# Altium project ominosc.PrjPCB (part 1 of 2)
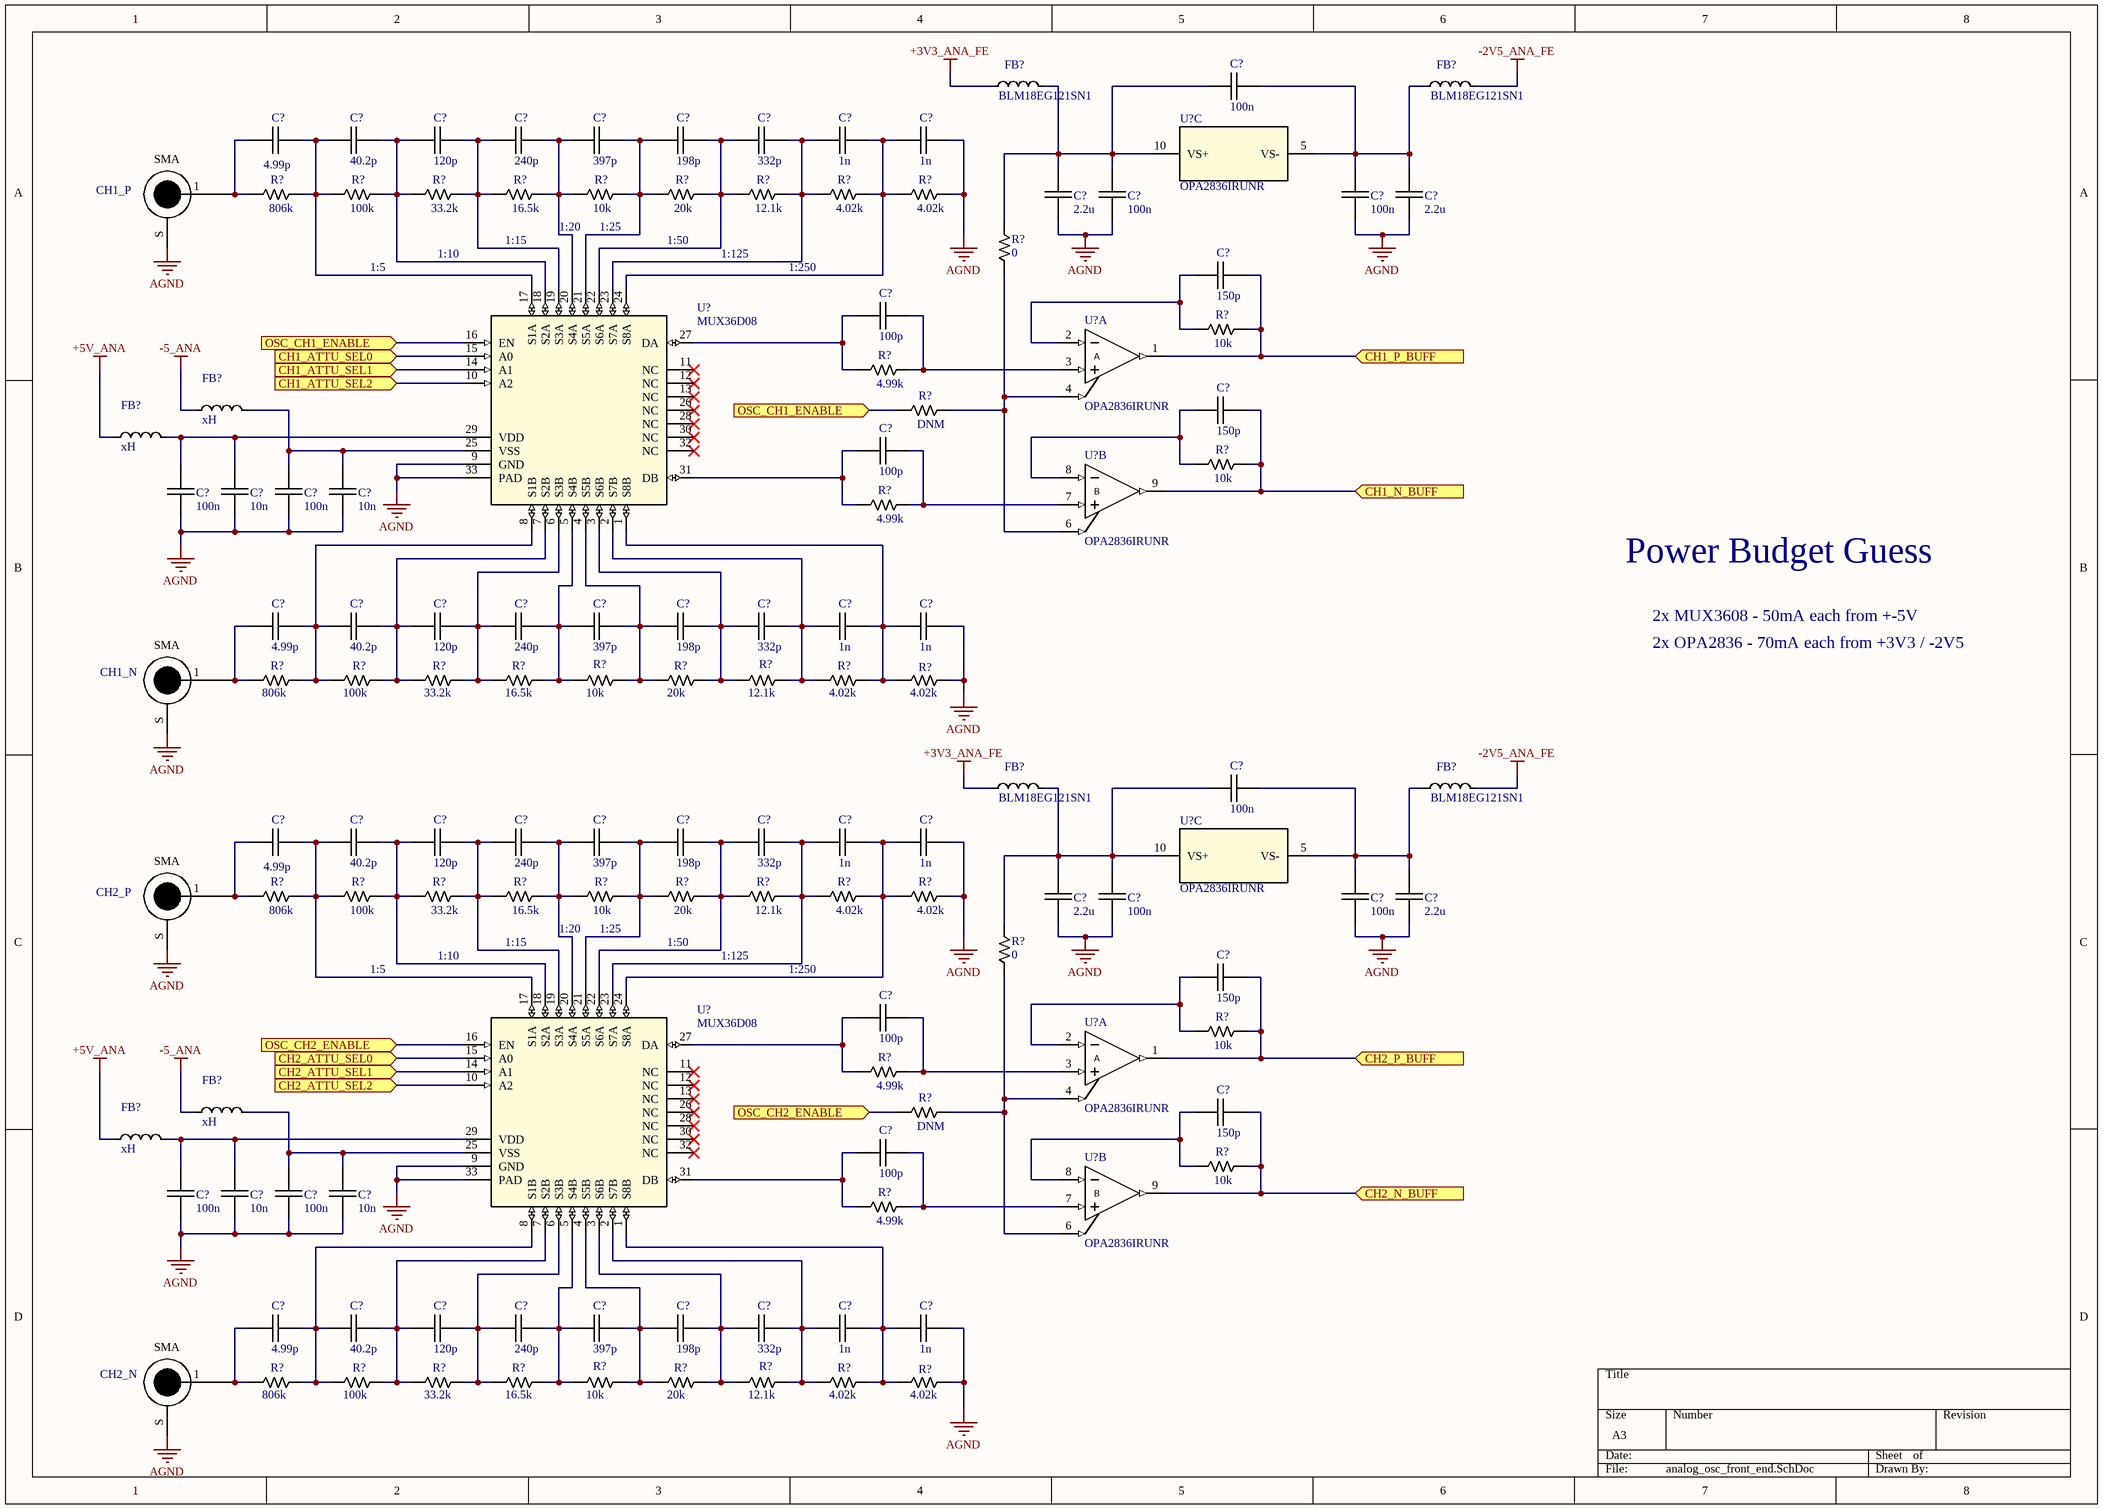
[diagram p0: analog_osc_front_end.SchDoc]
8 sheets, 454 parts. Net scope: flat (ports and power ports of the same name join across sheets).
Sheets:
  analog_osc_front_end.SchDoc
  analog_adc_front_end.SchDoc
  analog_clock_gen.SchDoc
  analog_adc_ref_offset.SchDoc
  analog_adc.SchDoc
  analog_power.SchDoc
  analog_dac.SchDoc
  analog_dac_ref_offset.SchDoc

## Sheet analog_osc_front_end.SchDoc
size A3

### Parts
(Parts that share a designator on the sheet are numbered #1, #2 ... from top to bottom, then left to right.)
C?#1  value 100n  [CAPC1005X06N]  (hidden comment: MLLC Capacitor)
C?#2  value 4.99p  [CAPC1005X06N]  (hidden comment: MLLC Capacitor)
C?#3  value 40.2p  [CAPC1005X06N]  (hidden comment: MLLC Capacitor)
C?#4  value 120p  [CAPC1005X06N]  (hidden comment: MLLC Capacitor)
C?#5  value 240p  [CAPC1005X06N]  (hidden comment: MLLC Capacitor)
C?#6  value 397p  [CAPC1005X06N]  (hidden comment: MLLC Capacitor)
C?#7  value 198p  [CAPC1005X06N]  (hidden comment: MLLC Capacitor)
C?#8  value 332p  [CAPC1005X06N]  (hidden comment: MLLC Capacitor)
C?#9  value 1n  [CAPC1005X06N]  (hidden comment: MLLC Capacitor)
C?#10  value 1n  [CAPC1005X06N]  (hidden comment: MLLC Capacitor)
C?#11  value 2.2u  [CAPC1005X06N]  (hidden comment: MLLC Capacitor)
C?#12  value 100n  [CAPC1005X06N]  (hidden comment: MLLC Capacitor)
C?#13  value 100n  [CAPC1005X06N]  (hidden comment: MLLC Capacitor)
C?#14  value 2.2u  [CAPC1005X06N]  (hidden comment: MLLC Capacitor)
C?#15  value 150p  [CAPC1005X06N]  (hidden comment: MLLC Capacitor)
C?#16  value 100p  [CAPC1005X06N]  (hidden comment: MLLC Capacitor)
C?#17  value 150p  [CAPC1005X06N]  (hidden comment: MLLC Capacitor)
C?#18  value 100p  [CAPC1005X06N]  (hidden comment: MLLC Capacitor)
C?#19  value 100n  [CAPC1005X06N]  (hidden comment: MLLC Capacitor)
C?#20  value 10n  [CAPC1005X06N]  (hidden comment: MLLC Capacitor)
C?#21  value 100n  [CAPC1005X06N]  (hidden comment: MLLC Capacitor)
C?#22  value 10n  [CAPC1005X06N]  (hidden comment: MLLC Capacitor)
C?#23  value 4.99p  [CAPC1005X06N]  (hidden comment: MLLC Capacitor)
C?#24  value 40.2p  [CAPC1005X06N]  (hidden comment: MLLC Capacitor)
C?#25  value 120p  [CAPC1005X06N]  (hidden comment: MLLC Capacitor)
C?#26  value 240p  [CAPC1005X06N]  (hidden comment: MLLC Capacitor)
C?#27  value 397p  [CAPC1005X06N]  (hidden comment: MLLC Capacitor)
C?#28  value 198p  [CAPC1005X06N]  (hidden comment: MLLC Capacitor)
C?#29  value 332p  [CAPC1005X06N]  (hidden comment: MLLC Capacitor)
C?#30  value 1n  [CAPC1005X06N]  (hidden comment: MLLC Capacitor)
C?#31  value 1n  [CAPC1005X06N]  (hidden comment: MLLC Capacitor)
C?#32  value 100n  [CAPC1005X06N]  (hidden comment: MLLC Capacitor)
C?#33  value 4.99p  [CAPC1005X06N]  (hidden comment: MLLC Capacitor)
C?#34  value 40.2p  [CAPC1005X06N]  (hidden comment: MLLC Capacitor)
C?#35  value 120p  [CAPC1005X06N]  (hidden comment: MLLC Capacitor)
C?#36  value 240p  [CAPC1005X06N]  (hidden comment: MLLC Capacitor)
C?#37  value 397p  [CAPC1005X06N]  (hidden comment: MLLC Capacitor)
C?#38  value 198p  [CAPC1005X06N]  (hidden comment: MLLC Capacitor)
C?#39  value 332p  [CAPC1005X06N]  (hidden comment: MLLC Capacitor)
C?#40  value 1n  [CAPC1005X06N]  (hidden comment: MLLC Capacitor)
C?#41  value 1n  [CAPC1005X06N]  (hidden comment: MLLC Capacitor)
C?#42  value 2.2u  [CAPC1005X06N]  (hidden comment: MLLC Capacitor)
C?#43  value 100n  [CAPC1005X06N]  (hidden comment: MLLC Capacitor)
C?#44  value 100n  [CAPC1005X06N]  (hidden comment: MLLC Capacitor)
C?#45  value 2.2u  [CAPC1005X06N]  (hidden comment: MLLC Capacitor)
C?#46  value 150p  [CAPC1005X06N]  (hidden comment: MLLC Capacitor)
C?#47  value 100p  [CAPC1005X06N]  (hidden comment: MLLC Capacitor)
C?#48  value 150p  [CAPC1005X06N]  (hidden comment: MLLC Capacitor)
C?#49  value 100p  [CAPC1005X06N]  (hidden comment: MLLC Capacitor)
C?#50  value 100n  [CAPC1005X06N]  (hidden comment: MLLC Capacitor)
C?#51  value 10n  [CAPC1005X06N]  (hidden comment: MLLC Capacitor)
C?#52  value 100n  [CAPC1005X06N]  (hidden comment: MLLC Capacitor)
C?#53  value 10n  [CAPC1005X06N]  (hidden comment: MLLC Capacitor)
C?#54  value 4.99p  [CAPC1005X06N]  (hidden comment: MLLC Capacitor)
C?#55  value 40.2p  [CAPC1005X06N]  (hidden comment: MLLC Capacitor)
C?#56  value 120p  [CAPC1005X06N]  (hidden comment: MLLC Capacitor)
C?#57  value 240p  [CAPC1005X06N]  (hidden comment: MLLC Capacitor)
C?#58  value 397p  [CAPC1005X06N]  (hidden comment: MLLC Capacitor)
C?#59  value 198p  [CAPC1005X06N]  (hidden comment: MLLC Capacitor)
C?#60  value 332p  [CAPC1005X06N]  (hidden comment: MLLC Capacitor)
C?#61  value 1n  [CAPC1005X06N]  (hidden comment: MLLC Capacitor)
C?#62  value 1n  [CAPC1005X06N]  (hidden comment: MLLC Capacitor)
CH1_N  SMA Edge  [SMA_EDGE]  (value not drawn)
CH1_P  SMA Edge  [SMA_EDGE]  (value not drawn)
CH2_N  SMA Edge  [SMA_EDGE]  (value not drawn)
CH2_P  SMA Edge  [SMA_EDGE]  (value not drawn)
FB?#1  value BLM18EG121SN1  [INDC1608X08N]  (hidden comment: Chip Inductor)
FB?#2  value BLM18EG121SN1  [INDC1608X08N]  (hidden comment: Chip Inductor)
FB?#3  value xH  [INDC2016X10N]  (hidden comment: Chip Inductor)
FB?#4  value xH  [INDC2016X10N]  (hidden comment: Chip Inductor)
FB?#5  value BLM18EG121SN1  [INDC1608X08N]  (hidden comment: Chip Inductor)
FB?#6  value BLM18EG121SN1  [INDC1608X08N]  (hidden comment: Chip Inductor)
FB?#7  value xH  [INDC2016X10N]  (hidden comment: Chip Inductor)
FB?#8  value xH  [INDC2016X10N]  (hidden comment: Chip Inductor)
R?#1  value 806k  [RESC1005X04N]  (hidden comment: Chip Resistor)
R?#2  value 100k  [RESC1005X04N]  (hidden comment: Chip Resistor)
R?#3  value 33.2k  [RESC1005X04N]  (hidden comment: Chip Resistor)
R?#4  value 16.5k  [RESC1005X04N]  (hidden comment: Chip Resistor)
R?#5  value 10k  [RESC1005X04N]  (hidden comment: Chip Resistor)
R?#6  value 20k  [RESC1005X04N]  (hidden comment: Chip Resistor)
R?#7  value 12.1k  [RESC1005X04N]  (hidden comment: Chip Resistor)
R?#8  value 4.02k  [RESC1005X04N]  (hidden comment: Chip Resistor)
R?#9  value 4.02k  [RESC1005X04N]  (hidden comment: Chip Resistor)
R?#10  value 0  [RESC1005X04N]  (hidden comment: Chip Resistor)
R?#11  value 10k  [RESC1005X04N]  (hidden comment: Chip Resistor)
R?#12  value 4.99k  [RESC1005X04N]  (hidden comment: Chip Resistor)
R?#13  value DNM  [RESC1005X04N]  (hidden comment: Chip Resistor)
R?#14  value 10k  [RESC1005X04N]  (hidden comment: Chip Resistor)
R?#15  value 4.99k  [RESC1005X04N]  (hidden comment: Chip Resistor)
R?#16  value 806k  [RESC1005X04N]  (hidden comment: Chip Resistor)
R?#17  value 100k  [RESC1005X04N]  (hidden comment: Chip Resistor)
R?#18  value 33.2k  [RESC1005X04N]  (hidden comment: Chip Resistor)
R?#19  value 16.5k  [RESC1005X04N]  (hidden comment: Chip Resistor)
R?#20  value 10k  [RESC1005X04N]  (hidden comment: Chip Resistor)
R?#21  value 20k  [RESC1005X04N]  (hidden comment: Chip Resistor)
R?#22  value 12.1k  [RESC1005X04N]  (hidden comment: Chip Resistor)
R?#23  value 4.02k  [RESC1005X04N]  (hidden comment: Chip Resistor)
R?#24  value 4.02k  [RESC1005X04N]  (hidden comment: Chip Resistor)
R?#25  value 806k  [RESC1005X04N]  (hidden comment: Chip Resistor)
R?#26  value 100k  [RESC1005X04N]  (hidden comment: Chip Resistor)
R?#27  value 33.2k  [RESC1005X04N]  (hidden comment: Chip Resistor)
R?#28  value 16.5k  [RESC1005X04N]  (hidden comment: Chip Resistor)
R?#29  value 10k  [RESC1005X04N]  (hidden comment: Chip Resistor)
R?#30  value 20k  [RESC1005X04N]  (hidden comment: Chip Resistor)
R?#31  value 12.1k  [RESC1005X04N]  (hidden comment: Chip Resistor)
R?#32  value 4.02k  [RESC1005X04N]  (hidden comment: Chip Resistor)
R?#33  value 4.02k  [RESC1005X04N]  (hidden comment: Chip Resistor)
R?#34  value 0  [RESC1005X04N]  (hidden comment: Chip Resistor)
R?#35  value 10k  [RESC1005X04N]  (hidden comment: Chip Resistor)
R?#36  value 4.99k  [RESC1005X04N]  (hidden comment: Chip Resistor)
R?#37  value DNM  [RESC1005X04N]  (hidden comment: Chip Resistor)
R?#38  value 10k  [RESC1005X04N]  (hidden comment: Chip Resistor)
R?#39  value 4.99k  [RESC1005X04N]  (hidden comment: Chip Resistor)
R?#40  value 806k  [RESC1005X04N]  (hidden comment: Chip Resistor)
R?#41  value 100k  [RESC1005X04N]  (hidden comment: Chip Resistor)
R?#42  value 33.2k  [RESC1005X04N]  (hidden comment: Chip Resistor)
R?#43  value 16.5k  [RESC1005X04N]  (hidden comment: Chip Resistor)
R?#44  value 10k  [RESC1005X04N]  (hidden comment: Chip Resistor)
R?#45  value 20k  [RESC1005X04N]  (hidden comment: Chip Resistor)
R?#46  value 12.1k  [RESC1005X04N]  (hidden comment: Chip Resistor)
R?#47  value 4.02k  [RESC1005X04N]  (hidden comment: Chip Resistor)
R?#48  value 4.02k  [RESC1005X04N]  (hidden comment: Chip Resistor)
U?#1  OPA2836IRUNR  [RUN0010A]  (part C of 3)
U?#2  OPA2836IRUNR  [RUN0010A]  (part A of 3)
U?#3  MUX36D08  [RTV0032E]
U?#4  OPA2836IRUNR  [RUN0010A]  (part B of 3)
U?#5  OPA2836IRUNR  [RUN0010A]  (part C of 3)
U?#6  OPA2836IRUNR  [RUN0010A]  (part A of 3)
U?#7  MUX36D08  [RTV0032E]
U?#8  OPA2836IRUNR  [RUN0010A]  (part B of 3)

### Ports
CH1_ATTU_SEL0 (in), CH1_ATTU_SEL1 (in), CH1_ATTU_SEL2 (in), CH1_N_BUFF (in), CH1_P_BUFF (in), CH2_ATTU_SEL0 (in), CH2_ATTU_SEL1 (in), CH2_ATTU_SEL2 (in), CH2_N_BUFF (in), CH2_P_BUFF (in), OSC_CH1_ENABLE (in), OSC_CH2_ENABLE (in)

### Nets
+3V3_ANA_FE: FB?#1.1 FB?#5.1
+5V_ANA: FB?#4.1 FB?#8.1
-2V5_ANA_FE: FB?#2.2 FB?#6.2
-5_ANA: FB?#3.1 FB?#7.1
AGND: C?#10.2 C?#11.1 C?#12.1 C?#13.1 C?#14.1 C?#19.1 C?#20.1 C?#21.1 C?#22.1 C?#31.2 C?#41.2 C?#42.1 C?#43.1 C?#44.1 C?#45.1 C?#50.1 C?#51.1 C?#52.1 C?#53.1 C?#62.2 CH1_N.S CH1_P.S CH2_N.S CH2_P.S R?#9.2 R?#24.2 R?#33.2 R?#48.2 U?#3.9(GND) U?#3.33(PAD) U?#7.9(GND) U?#7.33(PAD)
NetC?#1_1: C?#1.1 C?#13.2 C?#14.2 FB?#2.1 U?#1.5(VS-)
NetC?#1_2: C?#1.2 C?#11.2 C?#12.2 FB?#1.2 R?#10.2 U?#1.10(VS+)
NetC?#2_1: C?#2.1 CH1_P.1(FEED) R?#1.1
NetC?#2_2: C?#2.2 C?#3.1 R?#1.2 R?#2.1 U?#3.17(S1A)
NetC?#3_2: C?#3.2 C?#4.1 R?#2.2 R?#3.1 U?#3.18(S2A)
NetC?#4_2: C?#4.2 C?#5.1 R?#3.2 R?#4.1 U?#3.19(S3A)
NetC?#5_2: C?#5.2 C?#6.1 R?#4.2 R?#5.1 U?#3.20(S4A)
NetC?#6_2: C?#6.2 C?#7.1 R?#5.2 R?#6.1 U?#3.21(S5A)
NetC?#7_2: C?#7.2 C?#8.1 R?#6.2 R?#7.1 U?#3.22(S6A)
NetC?#8_2: C?#8.2 C?#9.1 R?#7.2 R?#8.1 U?#3.23(S7A)
NetC?#9_2: C?#9.2 C?#10.1 R?#8.2 R?#9.1 U?#3.24(S8A)
NetC?#15_1: C?#15.1 R?#11.1 U?#2.2(IN-)
NetC?#15_2: C?#15.2 R?#11.2 U?#2.1(VOUT1) ; port CH1_P_BUFF
NetC?#16_1: C?#16.1 R?#12.1 U?#3.27(DA)
NetC?#16_2: C?#16.2 R?#12.2 U?#2.3(IN+)
NetC?#17_1: C?#17.1 R?#14.1 U?#4.8(IN-)
NetC?#17_2: C?#17.2 R?#14.2 U?#4.9(VOUT2) ; port CH1_N_BUFF
NetC?#18_1: C?#18.1 R?#15.1 U?#3.31(DB)
NetC?#18_2: C?#18.2 R?#15.2 U?#4.7(IN+)
NetC?#19_2: C?#19.2 C?#20.2 FB?#4.2 U?#3.29(VDD)
NetC?#21_2: C?#21.2 C?#22.2 FB?#3.2 U?#3.25(VSS)
NetC?#23_1: C?#23.1 CH1_N.1(FEED) R?#16.1
NetC?#23_2: C?#23.2 C?#24.1 R?#16.2 R?#17.1 U?#3.8(S1B)
NetC?#24_2: C?#24.2 C?#25.1 R?#17.2 R?#18.1 U?#3.7(S2B)
NetC?#25_2: C?#25.2 C?#26.1 R?#18.2 R?#19.1 U?#3.6(S3B)
NetC?#26_2: C?#26.2 C?#27.1 R?#19.2 R?#20.1 U?#3.5(S4B)
NetC?#27_2: C?#27.2 C?#28.1 R?#20.2 R?#21.1 U?#3.4(S5B)
NetC?#28_2: C?#28.2 C?#29.1 R?#21.2 R?#22.1 U?#3.3(S6B)
NetC?#29_2: C?#29.2 C?#30.1 R?#22.2 R?#23.1 U?#3.2(S7B)
NetC?#30_2: C?#30.2 C?#31.1 R?#23.2 R?#24.1 U?#3.1(S8B)
NetC?#32_1: C?#32.1 C?#44.2 C?#45.2 FB?#6.1 U?#5.5(VS-)
NetC?#32_2: C?#32.2 C?#42.2 C?#43.2 FB?#5.2 R?#34.2 U?#5.10(VS+)
NetC?#33_1: C?#33.1 CH2_P.1(FEED) R?#25.1
NetC?#33_2: C?#33.2 C?#34.1 R?#25.2 R?#26.1 U?#7.17(S1A)
NetC?#34_2: C?#34.2 C?#35.1 R?#26.2 R?#27.1 U?#7.18(S2A)
NetC?#35_2: C?#35.2 C?#36.1 R?#27.2 R?#28.1 U?#7.19(S3A)
NetC?#36_2: C?#36.2 C?#37.1 R?#28.2 R?#29.1 U?#7.20(S4A)
NetC?#37_2: C?#37.2 C?#38.1 R?#29.2 R?#30.1 U?#7.21(S5A)
NetC?#38_2: C?#38.2 C?#39.1 R?#30.2 R?#31.1 U?#7.22(S6A)
NetC?#39_2: C?#39.2 C?#40.1 R?#31.2 R?#32.1 U?#7.23(S7A)
NetC?#40_2: C?#40.2 C?#41.1 R?#32.2 R?#33.1 U?#7.24(S8A)
NetC?#46_1: C?#46.1 R?#35.1 U?#6.2(IN-)
NetC?#46_2: C?#46.2 R?#35.2 U?#6.1(VOUT1) ; port CH2_P_BUFF
NetC?#47_1: C?#47.1 R?#36.1 U?#7.27(DA)
NetC?#47_2: C?#47.2 R?#36.2 U?#6.3(IN+)
NetC?#48_1: C?#48.1 R?#38.1 U?#8.8(IN-)
NetC?#48_2: C?#48.2 R?#38.2 U?#8.9(VOUT2) ; port CH2_N_BUFF
NetC?#49_1: C?#49.1 R?#39.1 U?#7.31(DB)
NetC?#49_2: C?#49.2 R?#39.2 U?#8.7(IN+)
NetC?#50_2: C?#50.2 C?#51.2 FB?#8.2 U?#7.29(VDD)
NetC?#52_2: C?#52.2 C?#53.2 FB?#7.2 U?#7.25(VSS)
NetC?#54_1: C?#54.1 CH2_N.1(FEED) R?#40.1
NetC?#54_2: C?#54.2 C?#55.1 R?#40.2 R?#41.1 U?#7.8(S1B)
NetC?#55_2: C?#55.2 C?#56.1 R?#41.2 R?#42.1 U?#7.7(S2B)
NetC?#56_2: C?#56.2 C?#57.1 R?#42.2 R?#43.1 U?#7.6(S3B)
NetC?#57_2: C?#57.2 C?#58.1 R?#43.2 R?#44.1 U?#7.5(S4B)
NetC?#58_2: C?#58.2 C?#59.1 R?#44.2 R?#45.1 U?#7.4(S5B)
NetC?#59_2: C?#59.2 C?#60.1 R?#45.2 R?#46.1 U?#7.3(S6B)
NetC?#60_2: C?#60.2 C?#61.1 R?#46.2 R?#47.1 U?#7.2(S7B)
NetC?#61_2: C?#61.2 C?#62.1 R?#47.2 R?#48.1 U?#7.1(S8B)
NetR?#10_1: R?#10.1 R?#13.2 U?#2.4(PD1_N) U?#4.6(PD2_N)
NetR?#13_1: R?#13.1 U?#3.16(EN) ; port OSC_CH1_ENABLE
NetR?#34_1: R?#34.1 R?#37.2 U?#6.4(PD1_N) U?#8.6(PD2_N)
NetR?#37_1: R?#37.1 U?#7.16(EN) ; port OSC_CH2_ENABLE
NetU?#3_10: U?#3.10(A2) ; port CH1_ATTU_SEL2
NetU?#3_14: U?#3.14(A1) ; port CH1_ATTU_SEL1
NetU?#3_15: U?#3.15(A0) ; port CH1_ATTU_SEL0
NetU?#7_10: U?#7.10(A2) ; port CH2_ATTU_SEL2
NetU?#7_14: U?#7.14(A1) ; port CH2_ATTU_SEL1
NetU?#7_15: U?#7.15(A0) ; port CH2_ATTU_SEL0

Not connected (* = marked no-connect by the designer): U?#3 11(NC)* 12(NC)* 13(NC)* 26(NC)* 28(NC)* 30(NC)* 32(NC)*; U?#7 11(NC)* 12(NC)* 13(NC)* 26(NC)* 28(NC)* 30(NC)* 32(NC)*

### Notes on the sheet
- (near R?#4) 1:15
- (near R?#5) 1:20
- (near R?#5) 1:25
- (near R?#6) 1:50
- 1:5
- 1:10
- 1:125
- 1:250
- Power Budget Guess
- 2x MUX3608 - 50mA each from +-5V
- 2x OPA2836 - 70mA each from +3V3 / -2V5
- (near R?#28) 1:15
- (near R?#29) 1:20
- (near R?#29) 1:25
- (near R?#30) 1:50
- (in symbol OPA2836IRUNR, part A) A
- (in symbol OPA2836IRUNR, part B) B
- (in symbol SMA Edge) SMA

### Library data of the parts
C?#1-C?#62 = Cap: Rating: *
CH1_N CH1_P CH2_N CH2_P = SMA Edge: Right Angle Edge Connector 1.6mm
FB?#1-FB?#8 = Ind
R?#1-R?#48 = Res
U?#1 U?#2 U?#4-U?#6 U?#8 = OPA2836IRUNR: Dual, Very Low Power, Rail to Rail out, Negative Rail in, VFB Op Amp, 205MHz BW, 120 MHz GBW; Manufacturer: Texas Instruments; PartNumber: OPA2836IRUNR; RefDes: RefDes; Type: DEV; Value: Value; Copyright: Copyright (C) 2018 Accelerated Designs. All rights reserved; ComponentLink1Description: Product Page; ComponentLink1URL: https://www.ti.com/product/OPA2836
U?#3 U?#7 = MUX36D08: 1-pA on-state leakage current, 36-V,dual 8:1, precision analog multiplexer; Manufacturer: Texas Instruments; PartNumber: MUX36D08IRTVR; RefDes: RefDes; Type: DEV; Value: Value; Copyright: Copyright (C) 2018 Accelerated Designs. All rights reserved; ComponentLink1Description: Product Page; ComponentLink1URL: https://www.ti.com/product/MUX36D08

## Sheet analog_adc_front_end.SchDoc
size A3
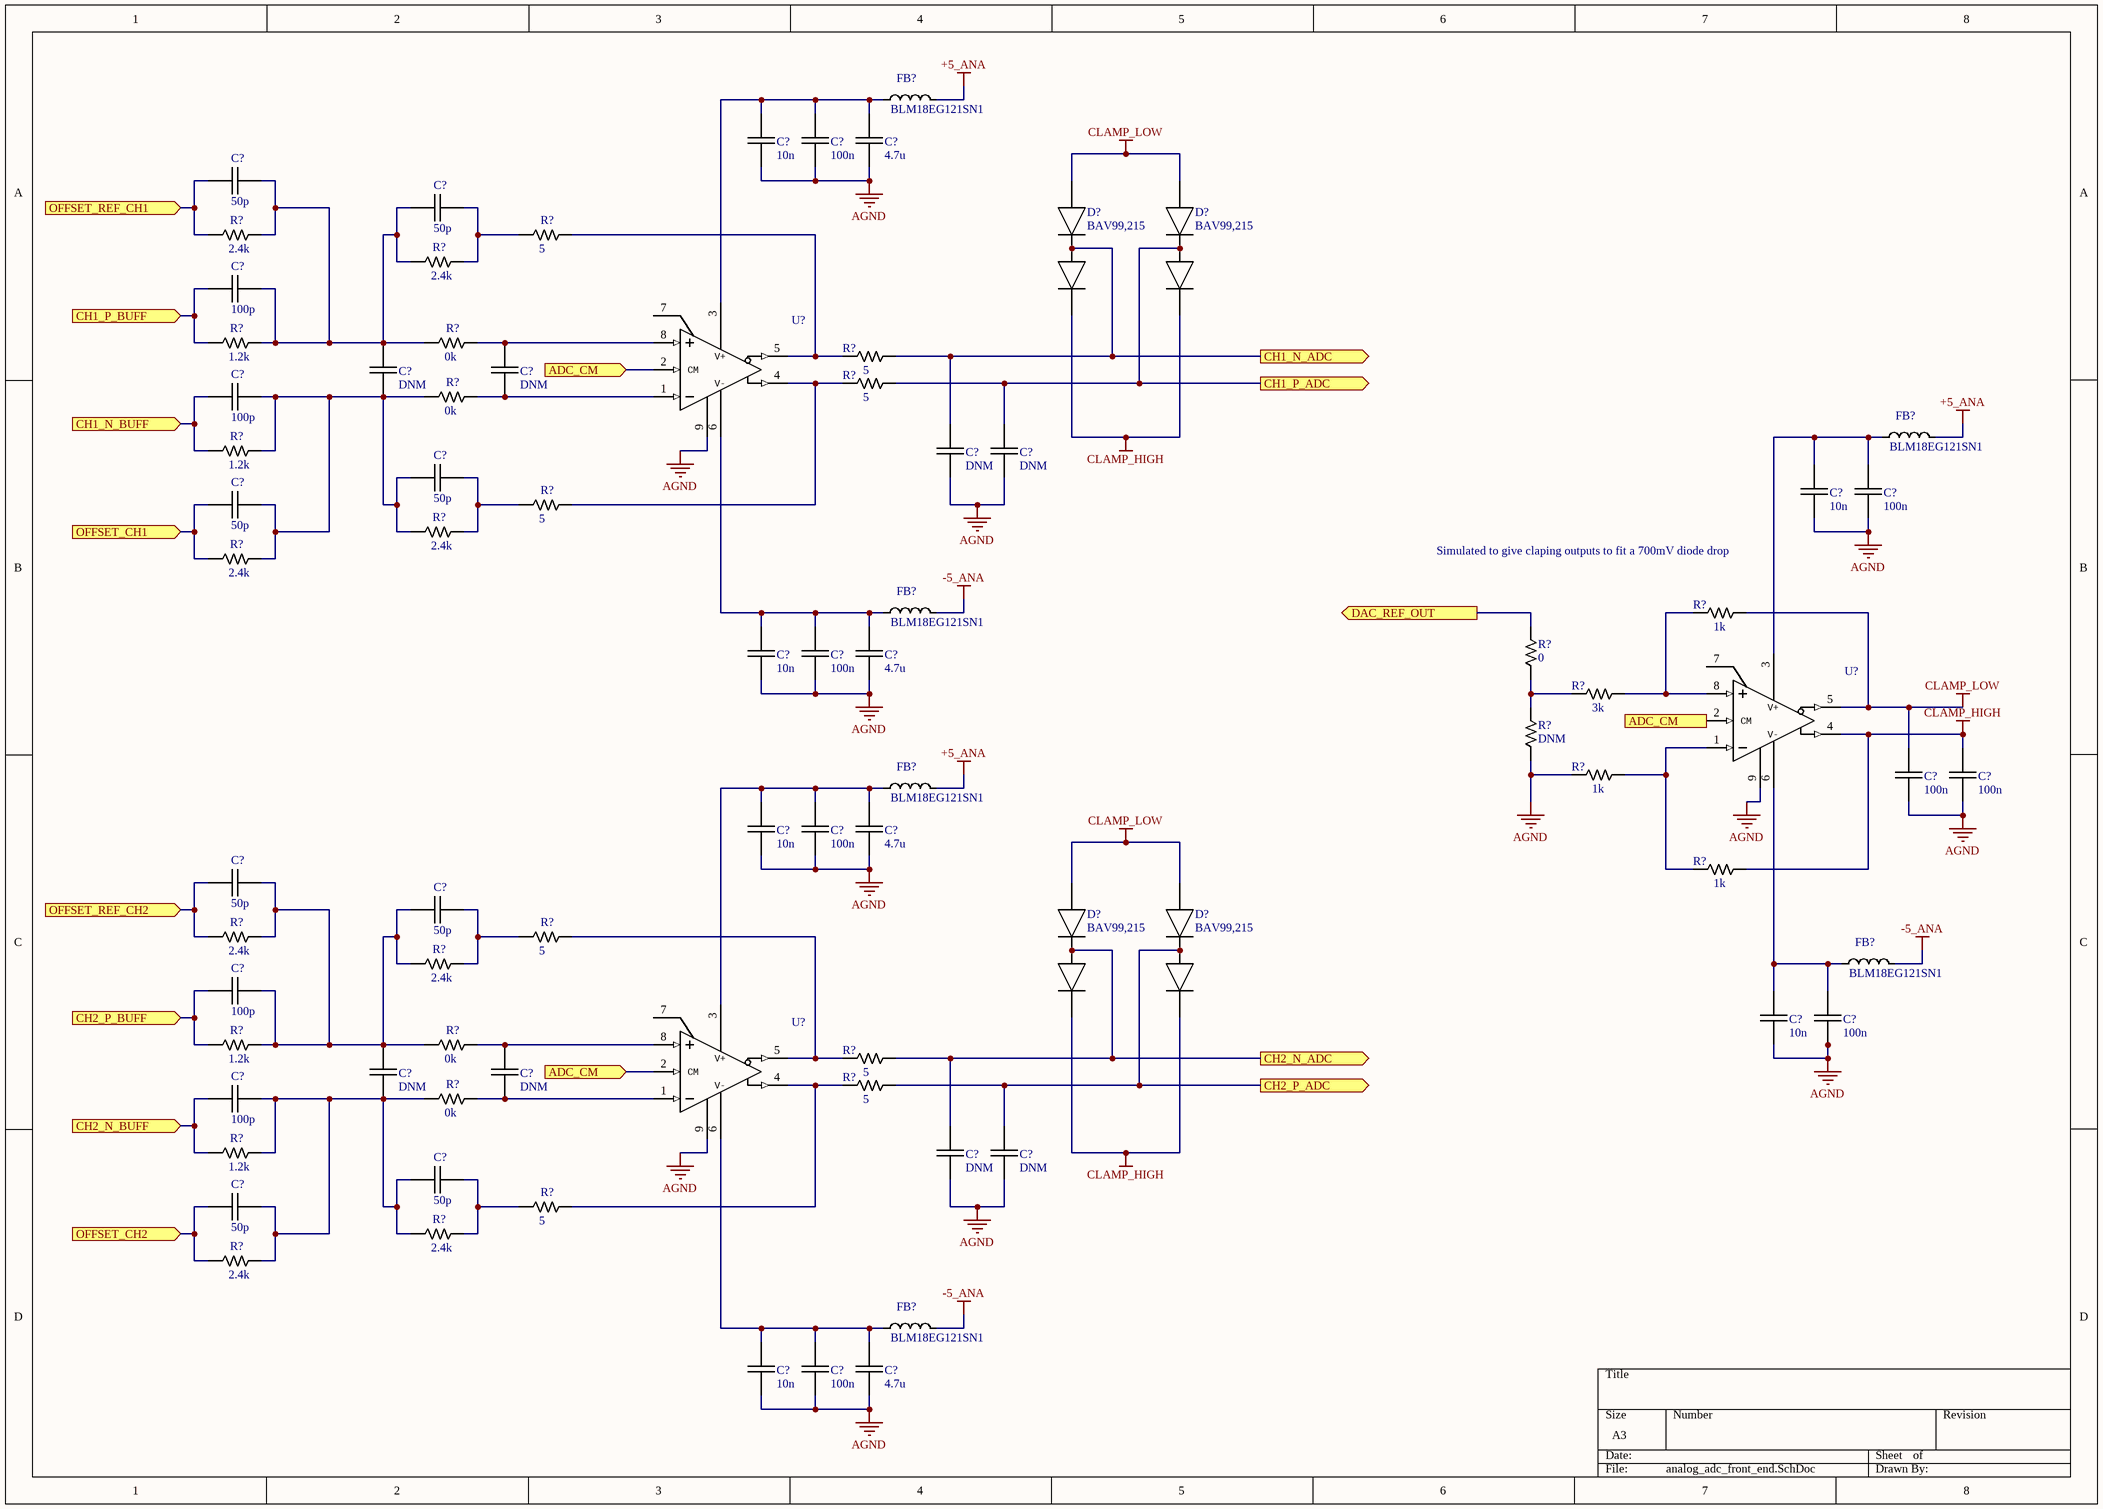
[diagram p1: analog_adc_front_end.SchDoc]

### Parts
(Parts that share a designator on the sheet are numbered #1, #2 ... from top to bottom, then left to right.)
C?#63  value 10n  [CAPC1005X06N]  (hidden comment: MLLC Capacitor)
C?#64  value 100n  [CAPC1005X06N]  (hidden comment: MLLC Capacitor)
C?#65  value 4.7u  [CAPC1608X09N]  (hidden comment: MLLC Capacitor)
C?#66  value 50p  [CAPC1005X06N]  (hidden comment: MLLC Capacitor)
C?#67  value 50p  [CAPC1005X06N]  (hidden comment: MLLC Capacitor)
C?#68  value 100p  [CAPC1005X06N]  (hidden comment: MLLC Capacitor)
C?#69  value DNM  [CAPC1005X06N]  (hidden comment: MLLC Capacitor)
C?#70  value DNM  [CAPC1005X06N]  (hidden comment: MLLC Capacitor)
C?#71  value 100p  [CAPC1005X06N]  (hidden comment: MLLC Capacitor)
C?#72  value DNM  [CAPC1005X06N]  (hidden comment: MLLC Capacitor)
C?#73  value DNM  [CAPC1005X06N]  (hidden comment: MLLC Capacitor)
C?#74  value 50p  [CAPC1005X06N]  (hidden comment: MLLC Capacitor)
C?#75  value 10n  [CAPC1005X06N]  (hidden comment: MLLC Capacitor)
C?#76  value 100n  [CAPC1005X06N]  (hidden comment: MLLC Capacitor)
C?#77  value 50p  [CAPC1005X06N]  (hidden comment: MLLC Capacitor)
C?#78  value 10n  [CAPC1005X06N]  (hidden comment: MLLC Capacitor)
C?#79  value 100n  [CAPC1005X06N]  (hidden comment: MLLC Capacitor)
C?#80  value 4.7u  [CAPC1608X09N]  (hidden comment: MLLC Capacitor)
C?#81  value 100n  [CAPC1005X06N]  (hidden comment: MLLC Capacitor)
C?#82  value 100n  [CAPC1005X06N]  (hidden comment: MLLC Capacitor)
C?#83  value 10n  [CAPC1005X06N]  (hidden comment: MLLC Capacitor)
C?#84  value 100n  [CAPC1005X06N]  (hidden comment: MLLC Capacitor)
C?#85  value 4.7u  [CAPC1608X09N]  (hidden comment: MLLC Capacitor)
C?#86  value 50p  [CAPC1005X06N]  (hidden comment: MLLC Capacitor)
C?#87  value 50p  [CAPC1005X06N]  (hidden comment: MLLC Capacitor)
C?#88  value 100p  [CAPC1005X06N]  (hidden comment: MLLC Capacitor)
C?#89  value 10n  [CAPC1005X06N]  (hidden comment: MLLC Capacitor)
C?#90  value 100n  [CAPC1005X06N]  (hidden comment: MLLC Capacitor)
C?#91  value DNM  [CAPC1005X06N]  (hidden comment: MLLC Capacitor)
C?#92  value DNM  [CAPC1005X06N]  (hidden comment: MLLC Capacitor)
C?#93  value 100p  [CAPC1005X06N]  (hidden comment: MLLC Capacitor)
C?#94  value DNM  [CAPC1005X06N]  (hidden comment: MLLC Capacitor)
C?#95  value DNM  [CAPC1005X06N]  (hidden comment: MLLC Capacitor)
C?#96  value 50p  [CAPC1005X06N]  (hidden comment: MLLC Capacitor)
C?#97  value 50p  [CAPC1005X06N]  (hidden comment: MLLC Capacitor)
C?#98  value 10n  [CAPC1005X06N]  (hidden comment: MLLC Capacitor)
C?#99  value 100n  [CAPC1005X06N]  (hidden comment: MLLC Capacitor)
C?#100  value 4.7u  [CAPC1608X09N]  (hidden comment: MLLC Capacitor)
D?#1  BAV99,215  [SOT95P245X110-3N]
D?#2  BAV99,215  [SOT95P245X110-3N]
D?#3  BAV99,215  [SOT95P245X110-3N]
D?#4  BAV99,215  [SOT95P245X110-3N]
FB?#9  value BLM18EG121SN1  [INDC1608X08N]  (hidden comment: Chip Inductor)
FB?#10  value BLM18EG121SN1  [INDC1608X08N]  (hidden comment: Chip Inductor)
FB?#11  value BLM18EG121SN1  [INDC1608X08N]  (hidden comment: Chip Inductor)
FB?#12  value BLM18EG121SN1  [INDC1608X08N]  (hidden comment: Chip Inductor)
FB?#13  value BLM18EG121SN1  [INDC1608X08N]  (hidden comment: Chip Inductor)
FB?#14  value BLM18EG121SN1  [INDC1608X08N]  (hidden comment: Chip Inductor)
R?#49  value 2.4k  [RESC1005X04N]  (hidden comment: Chip Resistor)
R?#50  value 5  [RESC1005X04N]  (hidden comment: Chip Resistor)
R?#51  value 2.4k  [RESC1005X04N]  (hidden comment: Chip Resistor)
R?#52  value 1.2k  [RESC1005X04N]  (hidden comment: Chip Resistor)
R?#53  value 0k  [RESC1005X04N]  (hidden comment: Chip Resistor)
R?#54  value 5  [RESC1005X04N]  (hidden comment: Chip Resistor)
R?#55  value 5  [RESC1005X04N]  (hidden comment: Chip Resistor)
R?#56  value 0k  [RESC1005X04N]  (hidden comment: Chip Resistor)
R?#57  value 1.2k  [RESC1005X04N]  (hidden comment: Chip Resistor)
R?#58  value 5  [RESC1005X04N]  (hidden comment: Chip Resistor)
R?#59  value 2.4k  [RESC1005X04N]  (hidden comment: Chip Resistor)
R?#60  value 2.4k  [RESC1005X04N]  (hidden comment: Chip Resistor)
R?#61  value 1k  [RESC1005X04N]  (hidden comment: Chip Resistor)
R?#62  value 0  [RESC1005X04N]  (hidden comment: Chip Resistor)
R?#63  value 3k  [RESC1005X04N]  (hidden comment: Chip Resistor)
R?#64  value DNM  [RESC1005X04N]  (hidden comment: Chip Resistor)
R?#65  value 1k  [RESC1005X04N]  (hidden comment: Chip Resistor)
R?#66  value 1k  [RESC1005X04N]  (hidden comment: Chip Resistor)
R?#67  value 2.4k  [RESC1005X04N]  (hidden comment: Chip Resistor)
R?#68  value 5  [RESC1005X04N]  (hidden comment: Chip Resistor)
R?#69  value 2.4k  [RESC1005X04N]  (hidden comment: Chip Resistor)
R?#70  value 1.2k  [RESC1005X04N]  (hidden comment: Chip Resistor)
R?#71  value 0k  [RESC1005X04N]  (hidden comment: Chip Resistor)
R?#72  value 5  [RESC1005X04N]  (hidden comment: Chip Resistor)
R?#73  value 5  [RESC1005X04N]  (hidden comment: Chip Resistor)
R?#74  value 0k  [RESC1005X04N]  (hidden comment: Chip Resistor)
R?#75  value 1.2k  [RESC1005X04N]  (hidden comment: Chip Resistor)
R?#76  value 5  [RESC1005X04N]  (hidden comment: Chip Resistor)
R?#77  value 2.4k  [RESC1005X04N]  (hidden comment: Chip Resistor)
R?#78  value 2.4k  [RESC1005X04N]  (hidden comment: Chip Resistor)
U?#9  THS4131CDGN  [DGN0008D_N]  (value not drawn)
U?#10  THS4131CDGN  [DGN0008D_N]  (value not drawn)
U?#11  THS4131CDGN  [DGN0008D_N]  (value not drawn)

### Ports
ADC_CM (in), CH1_N_ADC (out), CH1_N_BUFF (in), CH1_P_ADC (out), CH1_P_BUFF (in), CH2_N_ADC (out), CH2_N_BUFF (in), CH2_P_ADC (out), CH2_P_BUFF (in), DAC_REF_OUT (out), OFFSET_CH1 (in), OFFSET_CH2 (in), OFFSET_REF_CH1 (in), OFFSET_REF_CH2 (in)

### Nets
+5_ANA: FB?#9.2 FB?#10.2 FB?#12.2
-5_ANA: FB?#11.2 FB?#13.2 FB?#14.2
AGND: C?#63.1 C?#64.1 C?#65.1 C?#72.1 C?#73.1 C?#75.1 C?#76.1 C?#78.1 C?#79.1 C?#80.1 C?#81.1 C?#82.1 C?#83.1 C?#84.1 C?#85.1 C?#89.1 C?#90.1 C?#94.1 C?#95.1 C?#98.1 C?#99.1 C?#100.1 R?#64.1 R?#65.1 U?#9.9(PAD) U?#10.9(PAD) U?#11.9(PAD)
CLAMP_HIGH: C?#82.2 D?#1.2 D?#2.2 D?#3.2 D?#4.2 R?#66.2 U?#10.4(VOUT+)
CLAMP_LOW: C?#81.2 D?#1.1 D?#2.1 D?#3.1 D?#4.1 R?#61.2 U?#10.5(VOUT-)
DAC_REF_OUT: R?#62.2 ; port DAC_REF_OUT
NetC?#15_2: C?#68.1 R?#52.1 ; port CH1_P_BUFF
NetC?#17_2: C?#71.1 R?#57.1 ; port CH1_N_BUFF
NetC?#46_2: C?#88.1 R?#70.1 ; port CH2_P_BUFF
NetC?#48_2: C?#93.1 R?#75.1 ; port CH2_N_BUFF
NetC?#63_2: C?#63.2 C?#64.2 C?#65.2 FB?#9.1 U?#9.3(VCC+)
NetC?#66_1: C?#66.1 R?#49.1 ; port OFFSET_REF_CH1
NetC?#66_2: C?#66.2 C?#67.1 C?#68.2 C?#69.2 R?#49.2 R?#51.1 R?#52.2 R?#53.1
NetC?#67_2: C?#67.2 R?#50.1 R?#51.2
NetC?#69_1: C?#69.1 C?#71.2 C?#74.1 C?#77.2 R?#56.1 R?#57.2 R?#59.1 R?#60.2
NetC?#70_1: C?#70.1 R?#56.2 U?#9.1(VIN-)
NetC?#70_2: C?#70.2 R?#53.2 U?#9.8(VIN+)
NetC?#72_2: C?#72.2 D?#1.3 R?#54.2 ; port CH1_N_ADC
NetC?#73_2: C?#73.2 D?#2.3 R?#55.2 ; port CH1_P_ADC
NetC?#74_2: C?#74.2 R?#58.1 R?#59.2
NetC?#75_2: C?#75.2 C?#76.2 FB?#10.1 U?#10.3(VCC+)
NetC?#77_1: C?#77.1 R?#60.1 ; port OFFSET_CH1
NetC?#78_2: C?#78.2 C?#79.2 C?#80.2 FB?#11.1 U?#9.6(VCC-)
NetC?#83_2: C?#83.2 C?#84.2 C?#85.2 FB?#12.1 U?#11.3(VCC+)
NetC?#86_1: C?#86.1 R?#67.1 ; port OFFSET_REF_CH2
NetC?#86_2: C?#86.2 C?#87.1 C?#88.2 C?#91.2 R?#67.2 R?#69.1 R?#70.2 R?#71.1
NetC?#87_2: C?#87.2 R?#68.1 R?#69.2
NetC?#89_2: C?#89.2 C?#90.2 FB?#13.1 U?#10.6(VCC-)
NetC?#91_1: C?#91.1 C?#93.2 C?#96.1 C?#97.2 R?#74.1 R?#75.2 R?#77.1 R?#78.2
NetC?#92_1: C?#92.1 R?#74.2 U?#11.1(VIN-)
NetC?#92_2: C?#92.2 R?#71.2 U?#11.8(VIN+)
NetC?#94_2: C?#94.2 D?#3.3 R?#72.2 ; port CH2_N_ADC
NetC?#95_2: C?#95.2 D?#4.3 R?#73.2 ; port CH2_P_ADC
NetC?#96_2: C?#96.2 R?#76.1 R?#77.2
NetC?#97_1: C?#97.1 R?#78.1 ; port OFFSET_CH2
NetC?#98_2: C?#98.2 C?#99.2 C?#100.2 FB?#14.1 U?#11.6(VCC-)
NetC?#132_1: U?#9.2(VOCM) U?#10.2(VOCM) U?#11.2(VOCM) ; port ADC_CM
NetR?#50_2: R?#50.2 R?#54.1 U?#9.5(VOUT-)
NetR?#55_1: R?#55.1 R?#58.2 U?#9.4(VOUT+)
NetR?#61_1: R?#61.1 R?#63.2 U?#10.8(VIN+)
NetR?#62_1: R?#62.1 R?#63.1 R?#64.2
NetR?#65_2: R?#65.2 R?#66.1 U?#10.1(VIN-)
NetR?#68_2: R?#68.2 R?#72.1 U?#11.5(VOUT-)
NetR?#73_1: R?#73.1 R?#76.2 U?#11.4(VOUT+)

Not connected (* = marked no-connect by the designer): U?#9 7(NC); U?#10 7(NC); U?#11 7(NC)

### Notes on the sheet
- Simulated to give claping outputs to fit a 700mV diode drop
- (in symbol THS4131) V+; CM; V-

### Library data of the parts
C?#63-C?#100 = Cap: Rating: *
D?#1-D?#4 = BAV99,215: Diode Standard 100V 215mA Surface Mount SOT23, fast/ ultra-fast 4ns.
FB?#9-FB?#14 = Ind
R?#49-R?#78 = Res
U?#9-U?#11 = THS4131: Fully Differential Input/Output Low Noise Amplifier; PartNumber: THS4131CDGNR; Manufacturer: Texas Instruments; CompType: IC; PIN_COUNT: 9; Alternate_PartNumber: THS4131CDGN; PackageReference: DGN0008D; MountType: SMT; RoHS: Y; RefDes: RefDes; Type: DEV; Value: Value; Copyright: Copyright (C) 2018 Accelerated Designs. All rights reserved; ComponentLink1Description: Product Page; ComponentLink1URL: https://www.ti.com/product/THS4131

## Sheet analog_clock_gen.SchDoc
size A4
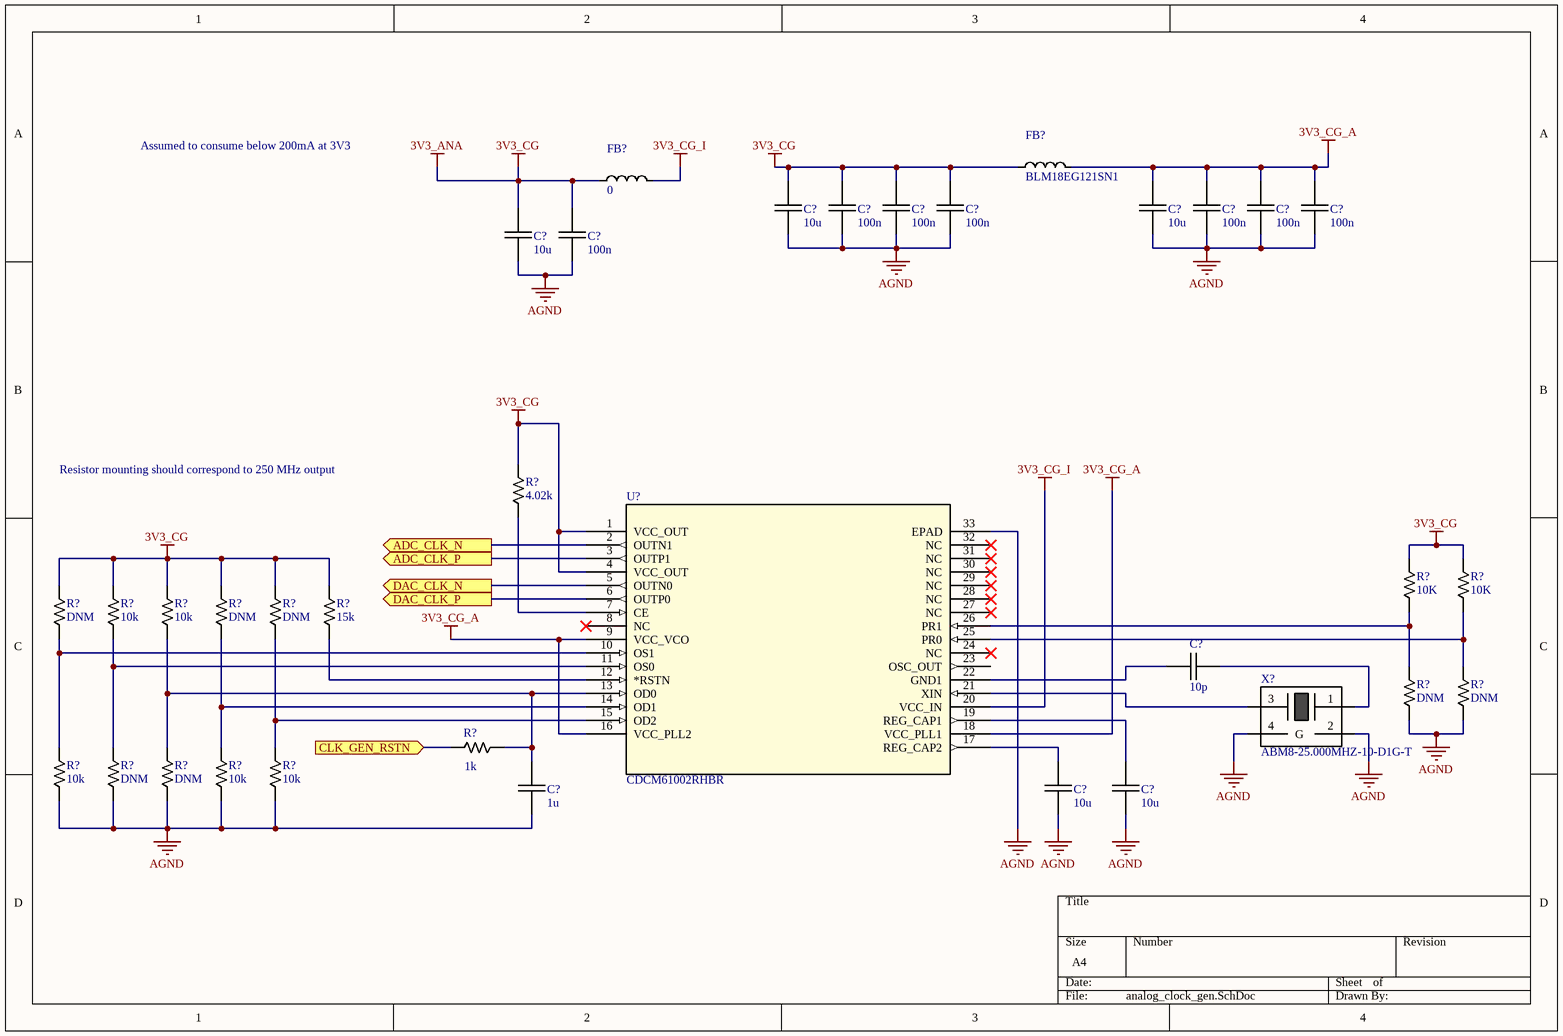
[diagram p2: analog_clock_gen.SchDoc]

### Parts
(Parts that share a designator on the sheet are numbered #1, #2 ... from top to bottom, then left to right.)
C?#101  value 10u  [CAPC1608X09N]  (hidden comment: MLLC Capacitor)
C?#102  value 100n  [CAPC1005X06N]  (hidden comment: MLLC Capacitor)
C?#103  value 100n  [CAPC1005X06N]  (hidden comment: MLLC Capacitor)
C?#104  value 100n  [CAPC1005X06N]  (hidden comment: MLLC Capacitor)
C?#105  value 10u  [CAPC1608X09N]  (hidden comment: MLLC Capacitor)
C?#106  value 100n  [CAPC1005X06N]  (hidden comment: MLLC Capacitor)
C?#107  value 100n  [CAPC1005X06N]  (hidden comment: MLLC Capacitor)
C?#108  value 100n  [CAPC1005X06N]  (hidden comment: MLLC Capacitor)
C?#109  value 10u  [CAPC1608X09N]  (hidden comment: MLLC Capacitor)
C?#110  value 100n  [CAPC1005X06N]  (hidden comment: MLLC Capacitor)
C?#111  value 10p  [CAPC1005X06N]  (hidden comment: MLLC Capacitor)
C?#112  value 1u  [CAPC1005X06N]  (hidden comment: MLLC Capacitor)
C?#113  value 10u  [CAPC1608X09N]  (hidden comment: MLLC Capacitor)
C?#114  value 10u  [CAPC1608X09N]  (hidden comment: MLLC Capacitor)
FB?#15  value BLM18EG121SN1  [INDC1608X08N]  (hidden comment: Chip Inductor)
FB?#16  value 0  [INDC1608X08N]  (hidden comment: Chip Inductor)
R?#79  value 4.02k  [RESC3216X06N]  (hidden comment: Chip Resistor)
R?#80  value 10K  [RESC3216X06N]  (hidden comment: Chip Resistor)
R?#81  value 10K  [RESC3216X06N]  (hidden comment: Chip Resistor)
R?#82  value DNM  [RESC3216X06N]  (hidden comment: Chip Resistor)
R?#83  value 10k  [RESC3216X06N]  (hidden comment: Chip Resistor)
R?#84  value 10k  [RESC3216X06N]  (hidden comment: Chip Resistor)
R?#85  value DNM  [RESC3216X06N]  (hidden comment: Chip Resistor)
R?#86  value DNM  [RESC3216X06N]  (hidden comment: Chip Resistor)
R?#87  value 15k  [RESC3216X06N]  (hidden comment: Chip Resistor)
R?#88  value DNM  [RESC3216X06N]  (hidden comment: Chip Resistor)
R?#89  value DNM  [RESC3216X06N]  (hidden comment: Chip Resistor)
R?#90  value 1k  [RESC3216X06N]  (hidden comment: Chip Resistor)
R?#91  value 10k  [RESC3216X06N]  (hidden comment: Chip Resistor)
R?#92  value DNM  [RESC3216X06N]  (hidden comment: Chip Resistor)
R?#93  value DNM  [RESC3216X06N]  (hidden comment: Chip Resistor)
R?#94  value 10k  [RESC3216X06N]  (hidden comment: Chip Resistor)
R?#95  value 10k  [RESC3216X06N]  (hidden comment: Chip Resistor)
U?#12  CDCM61002RHBR  [RHB32_3P45X3P45]
X?  ABM8-25.000MHZ-10-D1G-T  [ABM8_3P20X2P5]

### Ports
ADC_CLK_N (out), ADC_CLK_P (out), CLK_GEN_RSTN (in), DAC_CLK_N (out), DAC_CLK_P (out)

### Nets
3V3_ANA: C?#101.2 C?#102.2 C?#103.2 C?#104.2 C?#109.2 C?#110.2 FB?#15.1 FB?#16.1 R?#79.2 R?#80.2 R?#81.2 R?#82.2 R?#83.2 R?#84.2 R?#85.2 R?#86.2 R?#87.2 U?#12.1(VCC_OUT) U?#12.4(VCC_OUT)  [also labelled 3V3_CG]
3V3_CG_A: C?#105.2 C?#106.2 C?#107.2 C?#108.2 FB?#15.2 U?#12.9(VCC_VCO) U?#12.16(VCC_PLL2) U?#12.18(VCC_PLL1)
3V3_CG_I: FB?#16.2 U?#12.20(VCC_IN)
AGND: C?#101.1 C?#102.1 C?#103.1 C?#104.1 C?#105.1 C?#106.1 C?#107.1 C?#108.1 C?#109.1 C?#110.1 C?#112.1 C?#113.1 C?#114.1 R?#88.1 R?#89.1 R?#91.1 R?#92.1 R?#93.1 R?#94.1 R?#95.1 U?#12.33(EPAD) X?.2 X?.4(G)
NetC?#111_1: C?#111.1 X?.1
NetC?#111_2: C?#111.2 U?#12.22(GND1)
NetC?#112_2: C?#112.2 R?#84.1 R?#90.1 R?#93.2 U?#12.13(OD0)
NetC?#113_2: C?#113.2 U?#12.17(REG_CAP2)
NetC?#114_2: C?#114.2 U?#12.19(REG_CAP1)
NetC?#130_2: U?#12.3(OUTP1) ; port ADC_CLK_P
NetC?#131_2: U?#12.2(OUTN1) ; port ADC_CLK_N
NetR?#79_1: R?#79.1 U?#12.7(CE)
NetR?#80_1: R?#80.1 R?#88.2 U?#12.26(PR1)
NetR?#81_1: R?#81.1 R?#89.2 U?#12.25(PR0)
NetR?#82_1: R?#82.1 R?#91.2 U?#12.10(OS1)
NetR?#83_1: R?#83.1 R?#92.2 U?#12.11(OS0)
NetR?#85_1: R?#85.1 R?#94.2 U?#12.14(OD1)
NetR?#86_1: R?#86.1 R?#95.2 U?#12.15(OD2)
NetR?#87_1: R?#87.1 U?#12.12(*RSTN)
NetR?#90_2: R?#90.2 ; port CLK_GEN_RSTN
NetU?#12_5: U?#12.5(OUTN0) ; port DAC_CLK_N
NetU?#12_6: U?#12.6(OUTP0) ; port DAC_CLK_P
NetU?#12_21: U?#12.21(XIN) X?.3

Not connected (* = marked no-connect by the designer): U?#12 8(NC)* 23(OSC_OUT) 24(NC)* 27(NC)* 28(NC)* 29(NC)* 30(NC)* 31(NC)* 32(NC)*

### Notes on the sheet
- Assumed to consume below 200mA at 3V3
- Resistor mounting should correspond to 250 MHz output

### Library data of the parts
C?#101-C?#114 = Cap: Rating: *
FB?#15 FB?#16 = Ind
R?#79-R?#95 = Res
U?#12 = CDCM61002RHBR: 1:2 Ultra Low Jitter Crystal-In Clock Generator; Manufacturer: Texas Instruments; INDUSTRY_STD_PKG_TYPE: QFN; FAMILY_NAME: INTERNAL VCO OUTPUT; PIN_COUNT: 32; PACKAGE_DESIGNATOR: RHB; Datasheet_URL: http://www.ti.com/lit/gpn/CDCM61002; GENERIC_PART_NUMBER: CDCM61002; Copyright: Copyright (C) 2018 Accelerated Designs. All rights reserved; RefDes: RefDes; Type: DEV; ComponentLink1Description: Product Page; ComponentLink1URL: https://www.ti.com/product/CDCM61002
X? = ABM8-25.000MHZ: 25MHz ±10ppm Crystal 10pF 50 Ohms 4-SMD, No Lead

## Sheet analog_adc_ref_offset.SchDoc
size A4
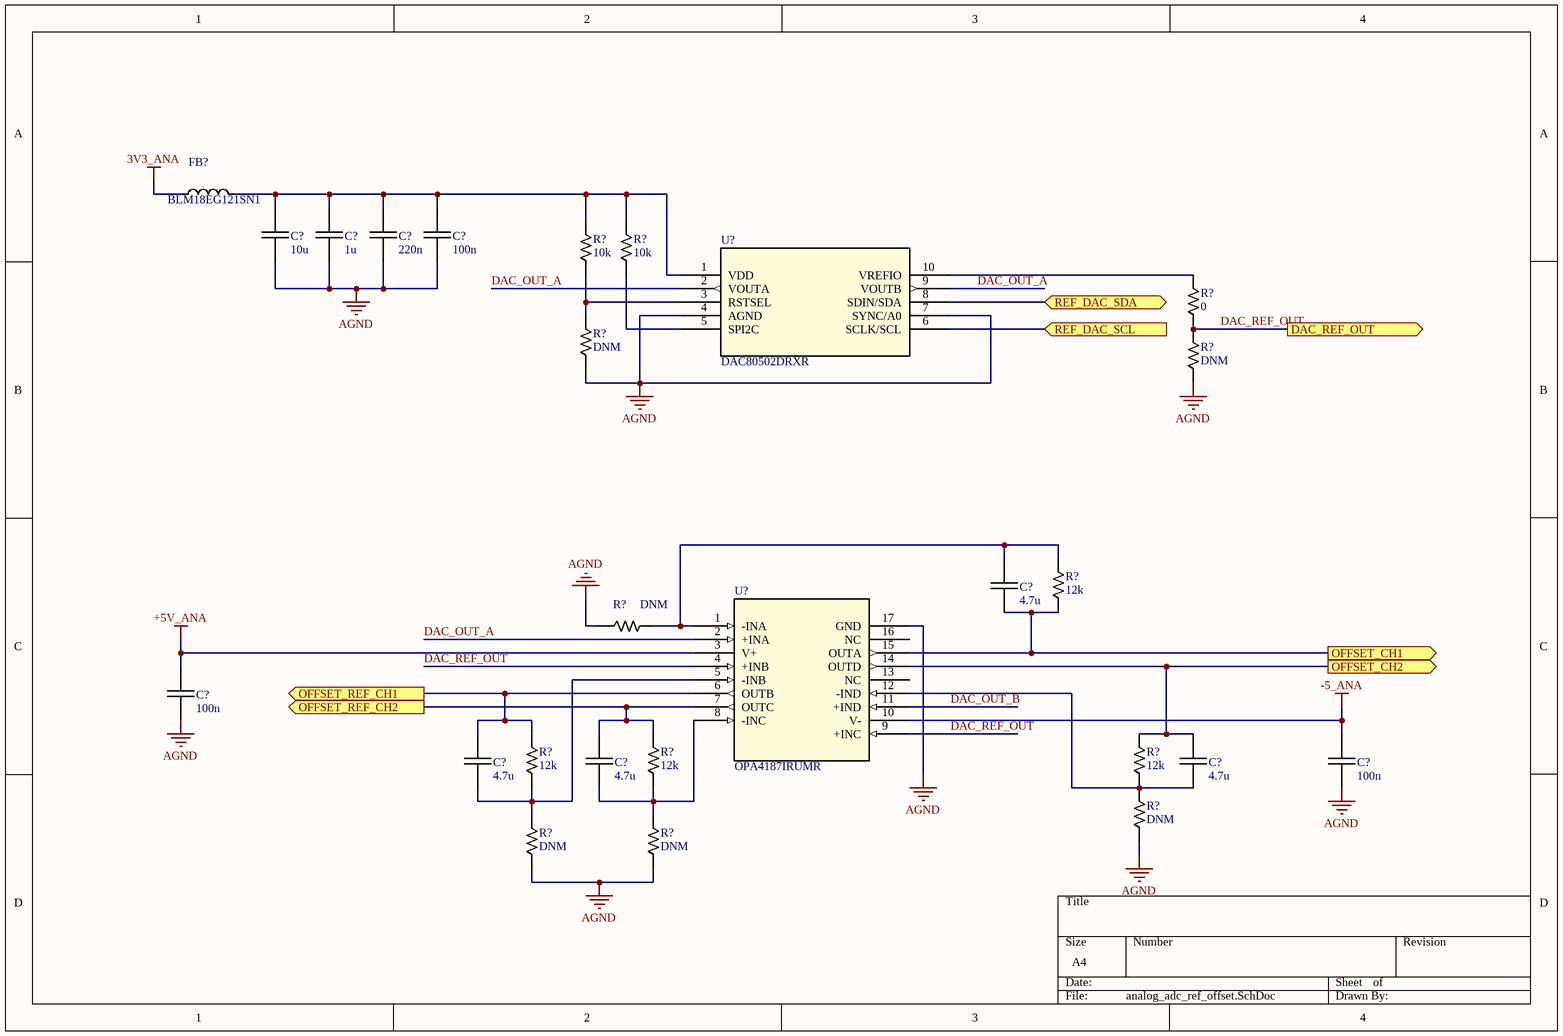
[diagram p3: analog_adc_ref_offset.SchDoc]

### Parts
(Parts that share a designator on the sheet are numbered #1, #2 ... from top to bottom, then left to right.)
C?#115  value 10u  [CAPC1608X09N]  (hidden comment: MLLC Capacitor)
C?#116  value 1u  [CAPC1005X06N]  (hidden comment: MLLC Capacitor)
C?#117  value 220n  [CAPC1005X06N]  (hidden comment: MLLC Capacitor)
C?#118  value 100n  [CAPC1005X06N]  (hidden comment: MLLC Capacitor)
C?#119  value 4.7u  [CAPC1005X06N]  (hidden comment: MLLC Capacitor)
C?#120  value 100n  [CAPC1005X06N]  (hidden comment: MLLC Capacitor)
C?#121  value 4.7u  [CAPC1005X06N]  (hidden comment: MLLC Capacitor)
C?#122  value 4.7u  [CAPC1005X06N]  (hidden comment: MLLC Capacitor)
C?#123  value 4.7u  [CAPC1005X06N]  (hidden comment: MLLC Capacitor)
C?#124  value 100n  [CAPC1005X06N]  (hidden comment: MLLC Capacitor)
FB?#17  value BLM18EG121SN1  [INDC1608X08N]  (hidden comment: Chip Inductor)
R?#96  value 10k  [RESC1005X04N]  (hidden comment: Chip Resistor)
R?#97  value 10k  [RESC1005X04N]  (hidden comment: Chip Resistor)
R?#98  value 0  [RESC1005X04N]  (hidden comment: Chip Resistor)
R?#99  value DNM  [RESC1005X04N]  (hidden comment: Chip Resistor)
R?#100  value DNM  [RESC1005X04N]  (hidden comment: Chip Resistor)
R?#101  value 12k  [RESC1005X04N]  (hidden comment: Chip Resistor)
R?#102  value DNM  [RESC1005X04N]  (hidden comment: Chip Resistor)
R?#103  value 12k  [RESC1005X04N]  (hidden comment: Chip Resistor)
R?#104  value 12k  [RESC1005X04N]  (hidden comment: Chip Resistor)
R?#105  value 12k  [RESC1005X04N]  (hidden comment: Chip Resistor)
R?#106  value DNM  [RESC1005X04N]  (hidden comment: Chip Resistor)
R?#107  value DNM  [RESC1005X04N]  (hidden comment: Chip Resistor)
R?#108  value DNM  [RESC1005X04N]  (hidden comment: Chip Resistor)
U?#13  DAC80502DRXR  [SON_02DRXR_TEX]
U?#14  OPA4187IRUMR  [RUM16_TEX]

### Ports
DAC_REF_OUT (out), OFFSET_CH1 (out), OFFSET_CH2 (out), OFFSET_REF_CH1 (out), OFFSET_REF_CH2 (out), REF_DAC_SCL (in), REF_DAC_SDA (bidir)

### Nets
3V3_ANA: FB?#17.1
+5V_ANA: C?#120.2 U?#14.3(V+)
-5_ANA: C?#124.2 U?#14.10(V-)
AGND: C?#115.1 C?#116.1 C?#117.1 C?#118.1 C?#120.1 C?#124.1 R?#99.1 R?#100.1 R?#102.1 R?#106.1 R?#107.1 R?#108.1 U?#13.4(AGND) U?#13.7(SYNC/A0) U?#14.17(GND)
DAC_OUT_A: U?#13.2(VOUTA) U?#13.9(VOUTB) U?#14.2(+INA)
DAC_OUT_B: U?#14.11(+IND)
DAC_REF_OUT: R?#98.1 R?#100.2 U?#14.4(+INB) U?#14.9(+INC) ; port DAC_REF_OUT
NetC?#66_1: C?#121.1 R?#103.2 U?#14.6(OUTB) ; port OFFSET_REF_CH1
NetC?#77_1: C?#119.2 R?#101.1 U?#14.15(OUTA) ; port OFFSET_CH1
NetC?#86_1: C?#122.1 R?#104.2 U?#14.7(OUTC) ; port OFFSET_REF_CH2
NetC?#97_1: C?#123.1 R?#105.2 U?#14.14(OUTD) ; port OFFSET_CH2
NetC?#115_2: C?#115.2 C?#116.2 C?#117.2 C?#118.2 FB?#17.2 R?#96.2 R?#97.2 U?#13.1(VDD)
NetC?#119_1: C?#119.1 R?#101.2 R?#102.2 U?#14.1(-INA)
NetC?#121_2: C?#121.2 R?#103.1 R?#107.2 U?#14.5(-INB)
NetC?#122_2: C?#122.2 R?#104.1 R?#108.2 U?#14.8(-INC)
NetC?#123_2: C?#123.2 R?#105.1 R?#106.2 U?#14.12(-IND)
NetR?#96_1: R?#96.1 R?#99.2 U?#13.3(RSTSEL)
NetR?#97_1: R?#97.1 U?#13.5(SPI2C)
NetR?#98_2: R?#98.2 U?#13.10(VREFIO)
NetU?#13_6: U?#13.6(SCLK/SCL) ; port REF_DAC_SCL
NetU?#13_8: U?#13.8(SDIN/SDA) ; port REF_DAC_SDA

Not connected (* = marked no-connect by the designer): U?#14 13(NC) 16(NC)

### Library data of the parts
C?#115-C?#124 = Cap: Rating: *
FB?#17 = Ind
R?#96-R?#108 = Res
U?#13 = DAC80502: Dual-channel, 1-LSB INL, 16-bit, SPI voltage-output digital-to-analog converter (DAC); Built_By: EMA_Matt; Vendor: Texas Instruments; SourceLibrary: TI_2020-07-16; Datasheet: https://www.ti.com/lit/ds/symlink/dac80502.pdf?ts=1594755472964&ref_url=https%253A%252F%252Fwww.ti.com%252Fstore%252Fti%252Fen%252Fp%252Fproduct%252F%253Fp%253DDAC80502DRXR; Copyright: Copyright (C) 2018 Accelerated Designs. All rights reserved; Manufacturer_Part_Number: DAC80502DRXR; RefDes: RefDes; Type: DEV; ComponentLink1Description: Product Page; ComponentLink1URL: https://www.ti.com/product/DAC80502
U?#14 = OPA4187: Zero-drift (10µV, 0.001µV/C˚), MUX-friendly, low-noise, RRO, CMOS quad precision op amp (quad); Vendor: Texas Instruments; Built_By: EMA_Cory; SourceLibrary: Add_to_database_2020-10-30; Datasheet: https://www.ti.com/lit/ds/symlink/opa4187.pdf?ts=1604082514403&ref_url=https%253A%252F%252Fwww.ti.com%252Fstore%252Fti%252Fen%252Fp%252Fproduct%252F%253Fp%253DOPA4187IRUMR; Manufacturer_Part_Number: OPA4187IRUMR; Copyright: Copyright (C) 2018 Accelerated Designs. All rights reserved; RefDes: RefDes; Type: DEV; ComponentLink1Description: Product Page; ComponentLink1URL: https://www.ti.com/product/OPA4187

## Sheet analog_adc.SchDoc
size A3
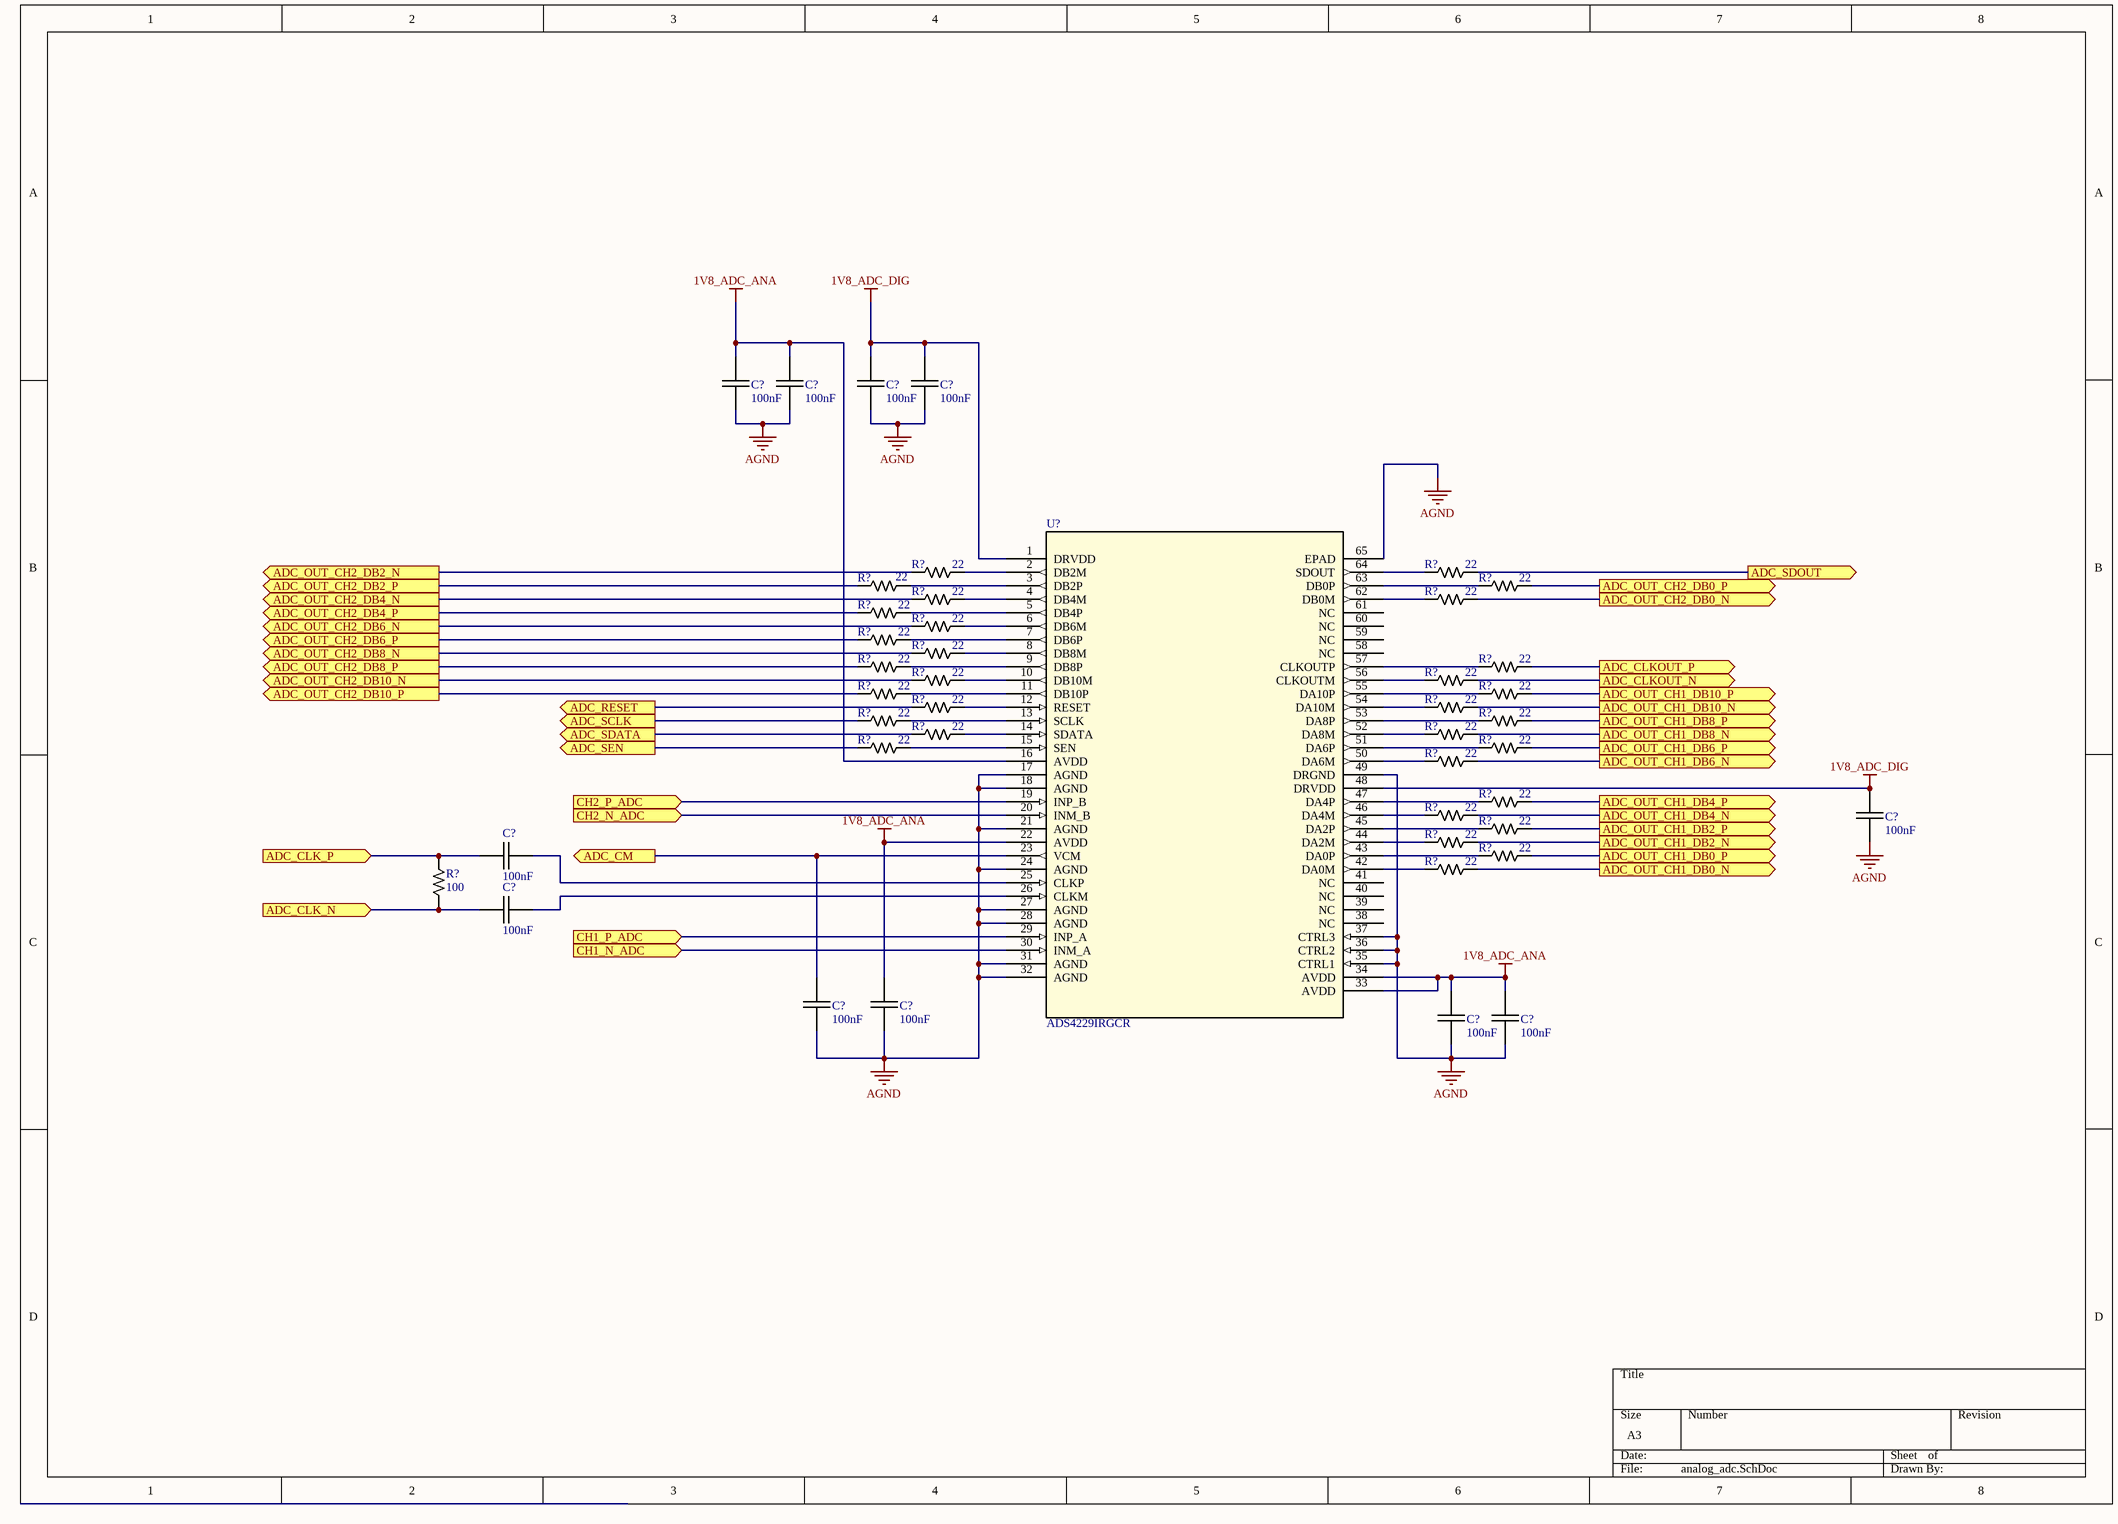
[diagram p4: analog_adc.SchDoc]

### Parts
(Parts that share a designator on the sheet are numbered #1, #2 ... from top to bottom, then left to right.)
C?#125  value 100nF  [CAPC1005X06N]  (hidden comment: MLLC Capacitor)
C?#126  value 100nF  [CAPC1005X06N]  (hidden comment: MLLC Capacitor)
C?#127  value 100nF  [CAPC1005X06N]  (hidden comment: MLLC Capacitor)
C?#128  value 100nF  [CAPC1005X06N]  (hidden comment: MLLC Capacitor)
C?#129  value 100nF  [CAPC1005X06N]  (hidden comment: MLLC Capacitor)
C?#130  value 100nF  [CAPC1005X06N]  (hidden comment: MLLC Capacitor)
C?#131  value 100nF  [CAPC1005X06N]  (hidden comment: MLLC Capacitor)
C?#132  value 100nF  [CAPC1005X06N]  (hidden comment: MLLC Capacitor)
C?#133  value 100nF  [CAPC1005X06N]  (hidden comment: MLLC Capacitor)
C?#134  value 100nF  [CAPC1005X06N]  (hidden comment: MLLC Capacitor)
C?#135  value 100nF  [CAPC1005X06N]  (hidden comment: MLLC Capacitor)
R?#109  value 22  [RESC1005X04N]  (hidden comment: Chip Resistor)
R?#110  value 22  [RESC1005X04N]  (hidden comment: Chip Resistor)
R?#111  value 22  [RESC1005X04N]  (hidden comment: Chip Resistor)
R?#112  value 22  [RESC1005X04N]  (hidden comment: Chip Resistor)
R?#113  value 22  [RESC1005X04N]  (hidden comment: Chip Resistor)
R?#114  value 22  [RESC1005X04N]  (hidden comment: Chip Resistor)
R?#115  value 22  [RESC1005X04N]  (hidden comment: Chip Resistor)
R?#116  value 22  [RESC1005X04N]  (hidden comment: Chip Resistor)
R?#117  value 22  [RESC1005X04N]  (hidden comment: Chip Resistor)
R?#118  value 22  [RESC1005X04N]  (hidden comment: Chip Resistor)
R?#119  value 22  [RESC1005X04N]  (hidden comment: Chip Resistor)
R?#120  value 22  [RESC1005X04N]  (hidden comment: Chip Resistor)
R?#121  value 22  [RESC1005X04N]  (hidden comment: Chip Resistor)
R?#122  value 22  [RESC1005X04N]  (hidden comment: Chip Resistor)
R?#123  value 22  [RESC1005X04N]  (hidden comment: Chip Resistor)
R?#124  value 22  [RESC1005X04N]  (hidden comment: Chip Resistor)
R?#125  value 22  [RESC1005X04N]  (hidden comment: Chip Resistor)
R?#126  value 22  [RESC1005X04N]  (hidden comment: Chip Resistor)
R?#127  value 22  [RESC1005X04N]  (hidden comment: Chip Resistor)
R?#128  value 22  [RESC1005X04N]  (hidden comment: Chip Resistor)
R?#129  value 22  [RESC1005X04N]  (hidden comment: Chip Resistor)
R?#130  value 22  [RESC1005X04N]  (hidden comment: Chip Resistor)
R?#131  value 22  [RESC1005X04N]  (hidden comment: Chip Resistor)
R?#132  value 22  [RESC1005X04N]  (hidden comment: Chip Resistor)
R?#133  value 22  [RESC1005X04N]  (hidden comment: Chip Resistor)
R?#134  value 22  [RESC1005X04N]  (hidden comment: Chip Resistor)
R?#135  value 22  [RESC1005X04N]  (hidden comment: Chip Resistor)
R?#136  value 22  [RESC1005X04N]  (hidden comment: Chip Resistor)
R?#137  value 22  [RESC1005X04N]  (hidden comment: Chip Resistor)
R?#138  value 22  [RESC1005X04N]  (hidden comment: Chip Resistor)
R?#139  value 22  [RESC1005X04N]  (hidden comment: Chip Resistor)
R?#140  value 100  [RESC1005X04N]  (hidden comment: Chip Resistor)
U?#15  ADS4229IRGCR  [RGC64_7P4X7P4]

### Ports
ADC_CLK_N (in), ADC_CLK_P (in), ADC_CLKOUT_N (out), ADC_CLKOUT_P (out), ADC_CM (out), ADC_OUT_CH1_DB0_N (out), ADC_OUT_CH1_DB0_P (out), ADC_OUT_CH1_DB2_N (out), ADC_OUT_CH1_DB2_P (out), ADC_OUT_CH1_DB4_N (out), ADC_OUT_CH1_DB4_P (out), ADC_OUT_CH1_DB6_N (out), ADC_OUT_CH1_DB6_P (out), ADC_OUT_CH1_DB8_N (out), ADC_OUT_CH1_DB8_P (out), ADC_OUT_CH1_DB10_N (out), ADC_OUT_CH1_DB10_P (out), ADC_OUT_CH2_DB0_N (out), ADC_OUT_CH2_DB0_P (out), ADC_OUT_CH2_DB2_N (out), ADC_OUT_CH2_DB2_P (out), ADC_OUT_CH2_DB4_N (out), ADC_OUT_CH2_DB4_P (out), ADC_OUT_CH2_DB6_N (out), ADC_OUT_CH2_DB6_P (out), ADC_OUT_CH2_DB8_N (out), ADC_OUT_CH2_DB8_P (out), ADC_OUT_CH2_DB10_N (out), ADC_OUT_CH2_DB10_P (out), ADC_RESET (out), ADC_SCLK (out), ADC_SDATA (out), ADC_SDOUT (out), ADC_SEN (out), CH1_N_ADC (in), CH1_P_ADC (in), CH2_N_ADC (in), CH2_P_ADC (in)

### Nets
1V8_ADC_ANA: C?#125.1 C?#126.1 C?#133.1 C?#134.1 C?#135.1 U?#15.16(AVDD) U?#15.22(AVDD) U?#15.33(AVDD) U?#15.34(AVDD)
1V8_ADC_DIG: C?#127.1 C?#128.1 C?#129.1 U?#15.1(DRVDD) U?#15.48(DRVDD)
AGND: C?#125.2 C?#126.2 C?#127.2 C?#128.2 C?#129.2 C?#132.2 C?#133.2 C?#134.2 C?#135.2 U?#15.17(AGND) U?#15.18(AGND) U?#15.21(AGND) U?#15.24(AGND) U?#15.27(AGND) U?#15.28(AGND) U?#15.31(AGND) U?#15.32(AGND) U?#15.35(CTRL1) U?#15.36(CTRL2) U?#15.37(CTRL3) U?#15.49(DRGND) U?#15.65(EPAD)
NetC?#72_2: U?#15.30(INM_A) ; port CH1_N_ADC
NetC?#73_2: U?#15.29(INP_A) ; port CH1_P_ADC
NetC?#94_2: U?#15.20(INM_B) ; port CH2_N_ADC
NetC?#95_2: U?#15.19(INP_B) ; port CH2_P_ADC
NetC?#130_1: C?#130.1 U?#15.25(CLKP)
NetC?#130_2: C?#130.2 R?#140.2 ; port ADC_CLK_P
NetC?#131_1: C?#131.1 U?#15.26(CLKM)
NetC?#131_2: C?#131.2 R?#140.1 ; port ADC_CLK_N
NetC?#132_1: C?#132.1 U?#15.23(VCM) ; port ADC_CM
NetR?#109_1: R?#109.1 U?#15.2(DB2M)
NetR?#109_2: R?#109.2 ; port ADC_OUT_CH2_DB2_N
NetR?#110_1: R?#110.1 ; port ADC_SDOUT
NetR?#110_2: R?#110.2 U?#15.64(SDOUT)
NetR?#111_1: R?#111.1 U?#15.3(DB2P)
NetR?#111_2: R?#111.2 ; port ADC_OUT_CH2_DB2_P
NetR?#112_1: R?#112.1 ; port ADC_OUT_CH2_DB0_P
NetR?#112_2: R?#112.2 U?#15.63(DB0P)
NetR?#113_1: R?#113.1 U?#15.4(DB4M)
NetR?#113_2: R?#113.2 ; port ADC_OUT_CH2_DB4_N
NetR?#114_1: R?#114.1 ; port ADC_OUT_CH2_DB0_N
NetR?#114_2: R?#114.2 U?#15.62(DB0M)
NetR?#115_1: R?#115.1 U?#15.5(DB4P)
NetR?#115_2: R?#115.2 ; port ADC_OUT_CH2_DB4_P
NetR?#116_1: R?#116.1 U?#15.6(DB6M)
NetR?#116_2: R?#116.2 ; port ADC_OUT_CH2_DB6_N
NetR?#117_1: R?#117.1 U?#15.7(DB6P)
NetR?#117_2: R?#117.2 ; port ADC_OUT_CH2_DB6_P
NetR?#118_1: R?#118.1 U?#15.8(DB8M)
NetR?#118_2: R?#118.2 ; port ADC_OUT_CH2_DB8_N
NetR?#119_1: R?#119.1 U?#15.9(DB8P)
NetR?#119_2: R?#119.2 ; port ADC_OUT_CH2_DB8_P
NetR?#120_1: R?#120.1 ; port ADC_CLKOUT_P
NetR?#120_2: R?#120.2 U?#15.57(CLKOUTP)
NetR?#121_1: R?#121.1 U?#15.10(DB10M)
NetR?#121_2: R?#121.2 ; port ADC_OUT_CH2_DB10_N
NetR?#122_1: R?#122.1 ; port ADC_CLKOUT_N
NetR?#122_2: R?#122.2 U?#15.56(CLKOUTM)
NetR?#123_1: R?#123.1 U?#15.11(DB10P)
NetR?#123_2: R?#123.2 ; port ADC_OUT_CH2_DB10_P
NetR?#124_1: R?#124.1 ; port ADC_OUT_CH1_DB10_P
NetR?#124_2: R?#124.2 U?#15.55(DA10P)
NetR?#125_1: R?#125.1 U?#15.12(RESET)
NetR?#125_2: R?#125.2 ; port ADC_RESET
NetR?#126_1: R?#126.1 ; port ADC_OUT_CH1_DB10_N
NetR?#126_2: R?#126.2 U?#15.54(DA10M)
NetR?#127_1: R?#127.1 U?#15.13(SCLK)
NetR?#127_2: R?#127.2 ; port ADC_SCLK
NetR?#128_1: R?#128.1 ; port ADC_OUT_CH1_DB8_P
NetR?#128_2: R?#128.2 U?#15.53(DA8P)
NetR?#129_1: R?#129.1 U?#15.14(SDATA)
NetR?#129_2: R?#129.2 ; port ADC_SDATA
NetR?#130_1: R?#130.1 ; port ADC_OUT_CH1_DB8_N
NetR?#130_2: R?#130.2 U?#15.52(DA8M)
NetR?#131_1: R?#131.1 U?#15.15(SEN)
NetR?#131_2: R?#131.2 ; port ADC_SEN
NetR?#132_1: R?#132.1 ; port ADC_OUT_CH1_DB6_P
NetR?#132_2: R?#132.2 U?#15.51(DA6P)
NetR?#133_1: R?#133.1 ; port ADC_OUT_CH1_DB6_N
NetR?#133_2: R?#133.2 U?#15.50(DA6M)
NetR?#134_1: R?#134.1 ; port ADC_OUT_CH1_DB4_P
NetR?#134_2: R?#134.2 U?#15.47(DA4P)
NetR?#135_1: R?#135.1 ; port ADC_OUT_CH1_DB4_N
NetR?#135_2: R?#135.2 U?#15.46(DA4M)
NetR?#136_1: R?#136.1 ; port ADC_OUT_CH1_DB2_P
NetR?#136_2: R?#136.2 U?#15.45(DA2P)
NetR?#137_1: R?#137.1 ; port ADC_OUT_CH1_DB2_N
NetR?#137_2: R?#137.2 U?#15.44(DA2M)
NetR?#138_1: R?#138.1 ; port ADC_OUT_CH1_DB0_P
NetR?#138_2: R?#138.2 U?#15.43(DA0P)
NetR?#139_1: R?#139.1 ; port ADC_OUT_CH1_DB0_N
NetR?#139_2: R?#139.2 U?#15.42(DA0M)

Not connected (* = marked no-connect by the designer): U?#15 38(NC) 39(NC) 40(NC) 41(NC) 58(NC) 59(NC) 60(NC) 61(NC)

### Library data of the parts
C?#125-C?#135 = Cap: Rating: *
R?#109-R?#140 = Res
U?#15 = ADS4229IRGCR: 12-Bit 250MSPS Dual Low Power ADC; Manufacturer: Texas Instruments; INDUSTRY_STD_PKG_TYPE: VQFN; FAMILY_NAME: HIGH SPEED ADC (>10MSPS); PIN_COUNT: 64; PACKAGE_DESIGNATOR: RGC; Datasheet_URL: http://www.ti.com/lit/gpn/ADS4229; GENERIC_PART_NUMBER: ADS4229; Copyright: Copyright (C) 2018 Accelerated Designs. All rights reserved; RefDes: RefDes; Type: DEV; ComponentLink1Description: Product Page; ComponentLink1URL: https://www.ti.com/product/ADS4229

## Sheet analog_power.SchDoc
size A3
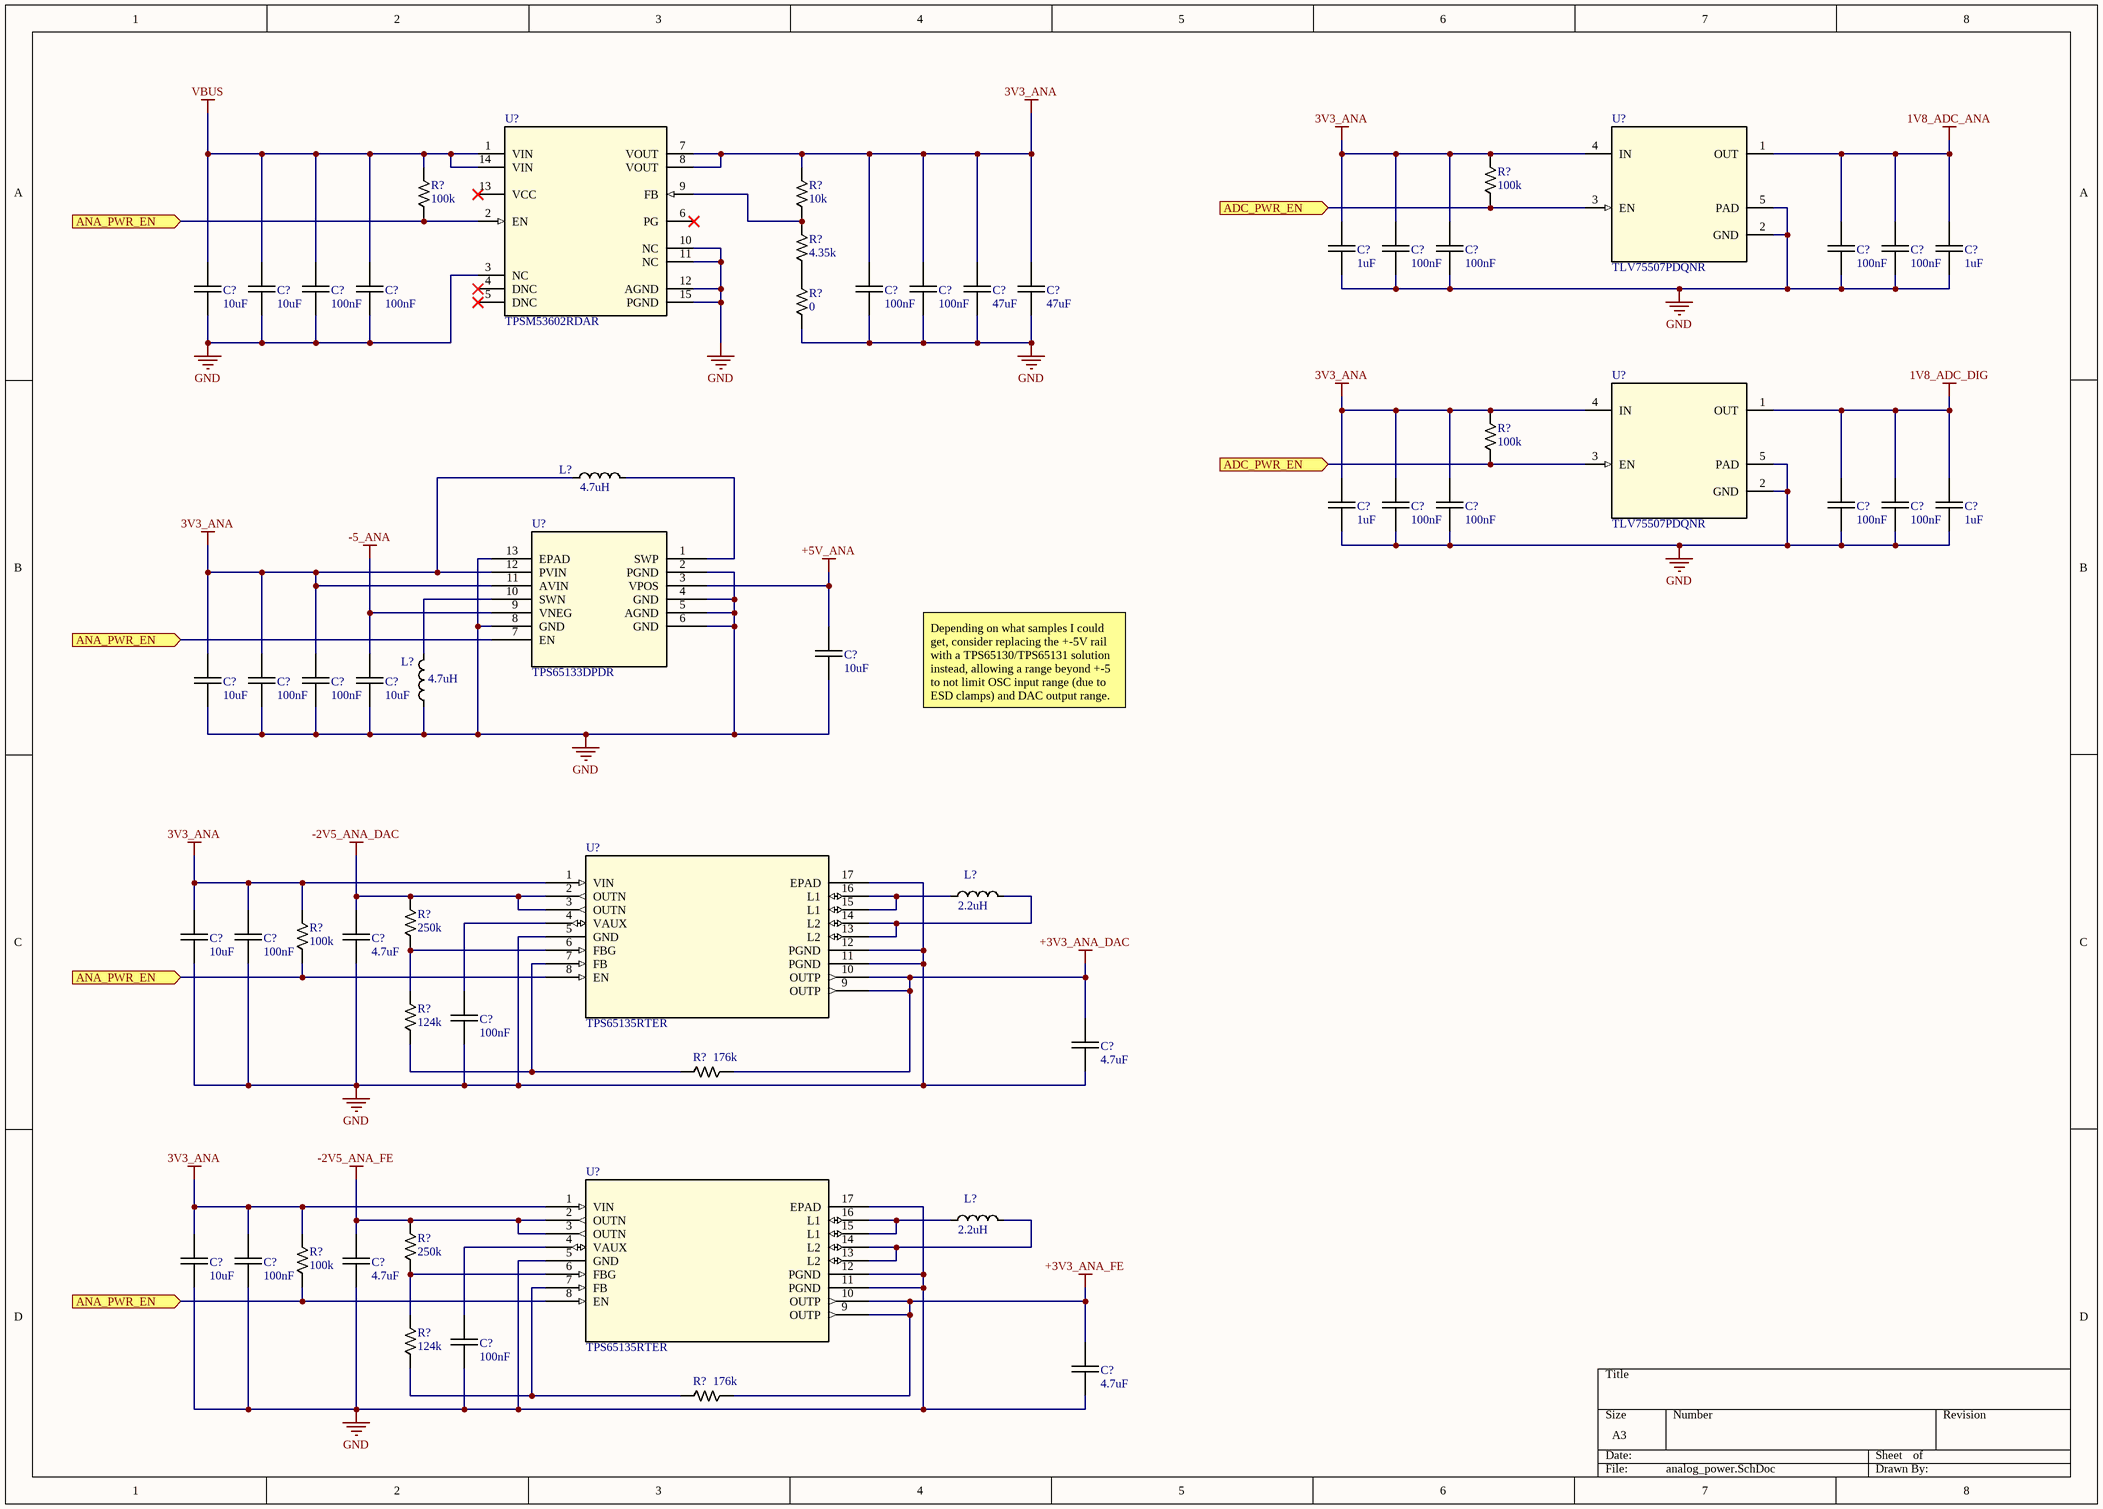
[diagram p5: analog_power.SchDoc]

### Parts
(Parts that share a designator on the sheet are numbered #1, #2 ... from top to bottom, then left to right.)
C?#136  value 1uF  [CAPC1005X06N]  (hidden comment: MLLC Capacitor)
C?#137  value 100nF  [CAPC1005X06N]  (hidden comment: MLLC Capacitor)
C?#138  value 100nF  [CAPC1005X06N]  (hidden comment: MLLC Capacitor)
C?#139  value 100nF  [CAPC1005X06N]  (hidden comment: MLLC Capacitor)
C?#140  value 100nF  [CAPC1005X06N]  (hidden comment: MLLC Capacitor)
C?#141  value 1uF  [CAPC1005X06N]  (hidden comment: MLLC Capacitor)
C?#142  value 10uF  [CAPC2012X14N]  (hidden comment: MLLC Capacitor)
C?#143  value 10uF  [CAPC2012X14N]  (hidden comment: MLLC Capacitor)
C?#144  value 100nF  [CAPC1005X06N]  (hidden comment: MLLC Capacitor)
C?#145  value 100nF  [CAPC1005X06N]  (hidden comment: MLLC Capacitor)
C?#146  value 100nF  [CAPC1005X06N]  (hidden comment: MLLC Capacitor)
C?#147  value 100nF  [CAPC1005X06N]  (hidden comment: MLLC Capacitor)
C?#148  value 47uF  [CAPC2012X14N]  (hidden comment: MLLC Capacitor)
C?#149  value 47uF  [CAPC2012X14N]  (hidden comment: MLLC Capacitor)
C?#150  value 1uF  [CAPC1005X06N]  (hidden comment: MLLC Capacitor)
C?#151  value 100nF  [CAPC1005X06N]  (hidden comment: MLLC Capacitor)
C?#152  value 100nF  [CAPC1005X06N]  (hidden comment: MLLC Capacitor)
C?#153  value 100nF  [CAPC1005X06N]  (hidden comment: MLLC Capacitor)
C?#154  value 100nF  [CAPC1005X06N]  (hidden comment: MLLC Capacitor)
C?#155  value 1uF  [CAPC1005X06N]  (hidden comment: MLLC Capacitor)
C?#156  value 10uF  [CAPC1608X09N]  (hidden comment: MLLC Capacitor)
C?#157  value 10uF  [CAPC1608X09N]  (hidden comment: MLLC Capacitor)
C?#158  value 100nF  [CAPC1005X06N]  (hidden comment: MLLC Capacitor)
C?#159  value 100nF  [CAPC1005X06N]  (hidden comment: MLLC Capacitor)
C?#160  value 10uF  [CAPC1608X09N]  (hidden comment: MLLC Capacitor)
C?#161  value 10uF  [CAPC1608X09N]  (hidden comment: MLLC Capacitor)
C?#162  value 100nF  [CAPC1005X06N]  (hidden comment: MLLC Capacitor)
C?#163  value 4.7uF  [CAPC1608X09N]  (hidden comment: MLLC Capacitor)
C?#164  value 100nF  [CAPC1005X06N]  (hidden comment: MLLC Capacitor)
C?#165  value 4.7uF  [CAPC1608X09N]  (hidden comment: MLLC Capacitor)
C?#166  value 10uF  [CAPC1608X09N]  (hidden comment: MLLC Capacitor)
C?#167  value 100nF  [CAPC1005X06N]  (hidden comment: MLLC Capacitor)
C?#168  value 4.7uF  [CAPC1608X09N]  (hidden comment: MLLC Capacitor)
C?#169  value 100nF  [CAPC1005X06N]  (hidden comment: MLLC Capacitor)
C?#170  value 4.7uF  [CAPC1608X09N]  (hidden comment: MLLC Capacitor)
L?#1  value 4.7uH  [INDC2520X12N]  (hidden comment: Chip Inductor)
L?#2  value 4.7uH  [INDC2520X12N]  (hidden comment: Chip Inductor)
L?#3  value 2.2uH  [INDC2520X12N]  (hidden comment: Chip Inductor)
L?#4  value 2.2uH  [INDC2520X12N]  (hidden comment: Chip Inductor)
R?#141  value 100k  [RESC1005X04N]  (hidden comment: Chip Resistor)
R?#142  value 100k  [RESC1005X04N]  (hidden comment: Chip Resistor)
R?#143  value 10k  [RESC1005X04N]  (hidden comment: Chip Resistor)
R?#144  value 4.35k  [RESC1005X04N]  (hidden comment: Chip Resistor)
R?#145  value 0  [RESC1005X04N]  (hidden comment: Chip Resistor)
R?#146  value 100k  [RESC1005X04N]  (hidden comment: Chip Resistor)
R?#147  value 250k  [RESC1005X04N]  (hidden comment: Chip Resistor)
R?#148  value 100k  [RESC1005X04N]  (hidden comment: Chip Resistor)
R?#149  value 124k  [RESC1005X04N]  (hidden comment: Chip Resistor)
R?#150  value 176k  [RESC1005X04N]  (hidden comment: Chip Resistor)
R?#151  value 250k  [RESC1005X04N]  (hidden comment: Chip Resistor)
R?#152  value 100k  [RESC1005X04N]  (hidden comment: Chip Resistor)
R?#153  value 124k  [RESC1005X04N]  (hidden comment: Chip Resistor)
R?#154  value 176k  [RESC1005X04N]  (hidden comment: Chip Resistor)
U?#16  TLV75507PDQNR  [DQN0004A]
U?#17  TPSM53602RDAR  [RDA0015A]
U?#18  TLV75507PDQNR  [DQN0004A]
U?#19  TPS65133DPDR  [DPD12_TEX]
U?#20  TPS65135RTER  [RTE16_1P7X1P7]
U?#21  TPS65135RTER  [RTE16_1P7X1P7]

### Ports
ADC_PWR_EN (in), ANA_PWR_EN (in)

### Nets
1V8_ADC_ANA: C?#139.1 C?#140.1 C?#141.1 U?#16.1(OUT)
1V8_ADC_DIG: C?#153.1 C?#154.1 C?#155.1 U?#18.1(OUT)
3V3_ANA: C?#136.1 C?#137.1 C?#138.1 C?#146.1 C?#147.1 C?#148.1 C?#149.1 C?#150.1 C?#151.1 C?#152.1 C?#157.1 C?#158.1 C?#159.1 C?#161.1 C?#162.1 C?#166.1 C?#167.1 L?#1.1 R?#141.2 R?#143.2 R?#146.2 R?#148.2 R?#152.2 U?#16.4(IN) U?#17.7(VOUT) U?#17.8(VOUT) U?#18.4(IN) U?#19.11(AVIN) U?#19.12(PVIN) U?#20.1(VIN) U?#21.1(VIN)
+3V3_ANA_DAC: C?#165.1 R?#150.1 U?#20.9(OUTP) U?#20.10(OUTP)
+3V3_ANA_FE: C?#170.1 R?#154.1 U?#21.9(OUTP) U?#21.10(OUTP)
+5V_ANA: C?#156.1 U?#19.3(VPOS)
-2V5_ANA_DAC: C?#163.1 R?#147.2 U?#20.2(OUTN) U?#20.3(OUTN)
-2V5_ANA_FE: C?#168.1 R?#151.2 U?#21.2(OUTN) U?#21.3(OUTN)
-5_ANA: C?#160.1 U?#19.9(VNEG)
GND: C?#136.2 C?#137.2 C?#138.2 C?#139.2 C?#140.2 C?#141.2 C?#142.2 C?#143.2 C?#144.2 C?#145.2 C?#146.2 C?#147.2 C?#148.2 C?#149.2 C?#150.2 C?#151.2 C?#152.2 C?#153.2 C?#154.2 C?#155.2 C?#156.2 C?#157.2 C?#158.2 C?#159.2 C?#160.2 C?#161.2 C?#162.2 C?#163.2 C?#164.2 C?#165.2 C?#166.2 C?#167.2 C?#168.2 C?#169.2 C?#170.2 L?#2.1 R?#145.1 U?#16.2(GND) U?#16.5(PAD) U?#17.3(NC) U?#17.10(NC) U?#17.11(NC) U?#17.12(AGND) U?#17.15(PGND) U?#18.2(GND) U?#18.5(PAD) U?#19.2(PGND) U?#19.4(GND) U?#19.5(AGND) U?#19.6(GND) U?#19.8(GND) U?#19.13(EPAD) U?#20.5(GND) U?#20.11(PGND) U?#20.12(PGND) U?#20.17(EPAD) U?#21.5(GND) U?#21.11(PGND) U?#21.12(PGND) U?#21.17(EPAD)
VBUS: C?#142.1 C?#143.1 C?#144.1 C?#145.1 R?#142.2 U?#17.1(VIN) U?#17.14(VIN)
NetC?#164_1: C?#164.1 U?#20.4(VAUX)
NetC?#169_1: C?#169.1 U?#21.4(VAUX)
NetL?#1_2: L?#1.2 U?#19.1(SWP)
NetL?#2_2: L?#2.2 U?#19.10(SWN)
NetL?#3_1: L?#3.1 U?#20.15(L1) U?#20.16(L1)
NetL?#3_2: L?#3.2 U?#20.13(L2) U?#20.14(L2)
NetL?#4_1: L?#4.1 U?#21.15(L1) U?#21.16(L1)
NetL?#4_2: L?#4.2 U?#21.13(L2) U?#21.14(L2)
NetR?#141_1: R?#141.1 R?#146.1 U?#16.3(EN) U?#18.3(EN) ; port ADC_PWR_EN
NetR?#142_1: R?#142.1 R?#148.1 R?#152.1 U?#17.2(EN) U?#19.7(EN) U?#20.8(EN) U?#21.8(EN) ; port ANA_PWR_EN
NetR?#143_1: R?#143.1 R?#144.2 U?#17.9(FB)
NetR?#144_1: R?#144.1 R?#145.2
NetR?#147_1: R?#147.1 R?#149.2 U?#20.6(FBG)
NetR?#149_1: R?#149.1 R?#150.2 U?#20.7(FB)
NetR?#151_1: R?#151.1 R?#153.2 U?#21.6(FBG)
NetR?#153_1: R?#153.1 R?#154.2 U?#21.7(FB)

Not connected (* = marked no-connect by the designer): U?#17 4(DNC)* 5(DNC)* 6(PG)* 13(VCC)*

### Notes on the sheet
- Depending on what samples I could get, consider replacing the +-5V rail with a TPS65130/TPS65131 solution instead, allowing a range beyond +-5 to not limit OSC input range (due to ESD clamps) and DAC output range.

### Library data of the parts
C?#136-C?#170 = Cap: Rating: *
L?#1-L?#4 = Ind: muRata 1239as-h-4r7m
R?#141-R?#154 = Res
U?#16 U?#18 = TLV755P: Fixed output, 500-mA, high-PSRR, low-IQ, low-dropout voltage regulator with enable; PartNumber: TLV75533PDQNR; Manufacturer: Texas Instruments; RefDes: RefDes; Type: DEV; Value: Value; Copyright: Copyright (C) 2018 Accelerated Designs. All rights reserved; ComponentLink1Description: Product Page; ComponentLink1URL: https://www.ti.com/product/TLV755P
U?#17 = TPSM53602: 36-V, 2-A step-down power module in small 5.5 x 5 x 4-mm Enhanced HotRod™ QFN with simple footprint; Manufacturer: Texas Instruments; PartNumber: TPSM53602RDAR; RefDes: RefDes; Type: DEV; Value: Value; Copyright: Copyright (C) 2018 Accelerated Designs. All rights reserved; ComponentLink1Description: Product Page; ComponentLink1URL: https://www.ti.com/product/TPSM53602
U?#19 = TPS65133: Split-Rail Converter, ±5V, 250mA Dual Output Power Supply; Vendor: Texas Instruments; Built_By: EMA_Molly; SourceLibrary: TI_2019-05-24; Manufacturer_Part_Number: TPS65133DPDR; Copyright: Copyright (C) 2018 Accelerated Designs. All rights reserved; RefDes: RefDes; Type: DEV; ComponentLink1Description: Product Page; ComponentLink1URL: https://www.ti.com/product/TPS65133
U?#20 U?#21 = TPS65135: Single-Inductor,Multiple-Output(SIMO)Regulator; Vendor: Texas Instruments; PACKAGE_DESIGNATOR: RTE; PIN_COUNT: 16; FAMILY_NAME: LCD/OLED DISPLAY BIAS SOLUTIONS; INDUSTRY_STD_PKG_TYPE: WQFN; Manufacturer_Part_Number: TPS65135RTER; GENERIC_PART_NUMBER: TPS65135; Datasheet_URL: http://www.ti.com/lit/gpn/TPS65135; Manufacturer: Texas Instruments; Copyright: Copyright (C) 2018 Accelerated Designs. All rights reserved; RefDes: RefDes; Type: Type